# EAGLE schematic DM04ttl (EAGLE 6.6.0)

## Sheet 1 of 6
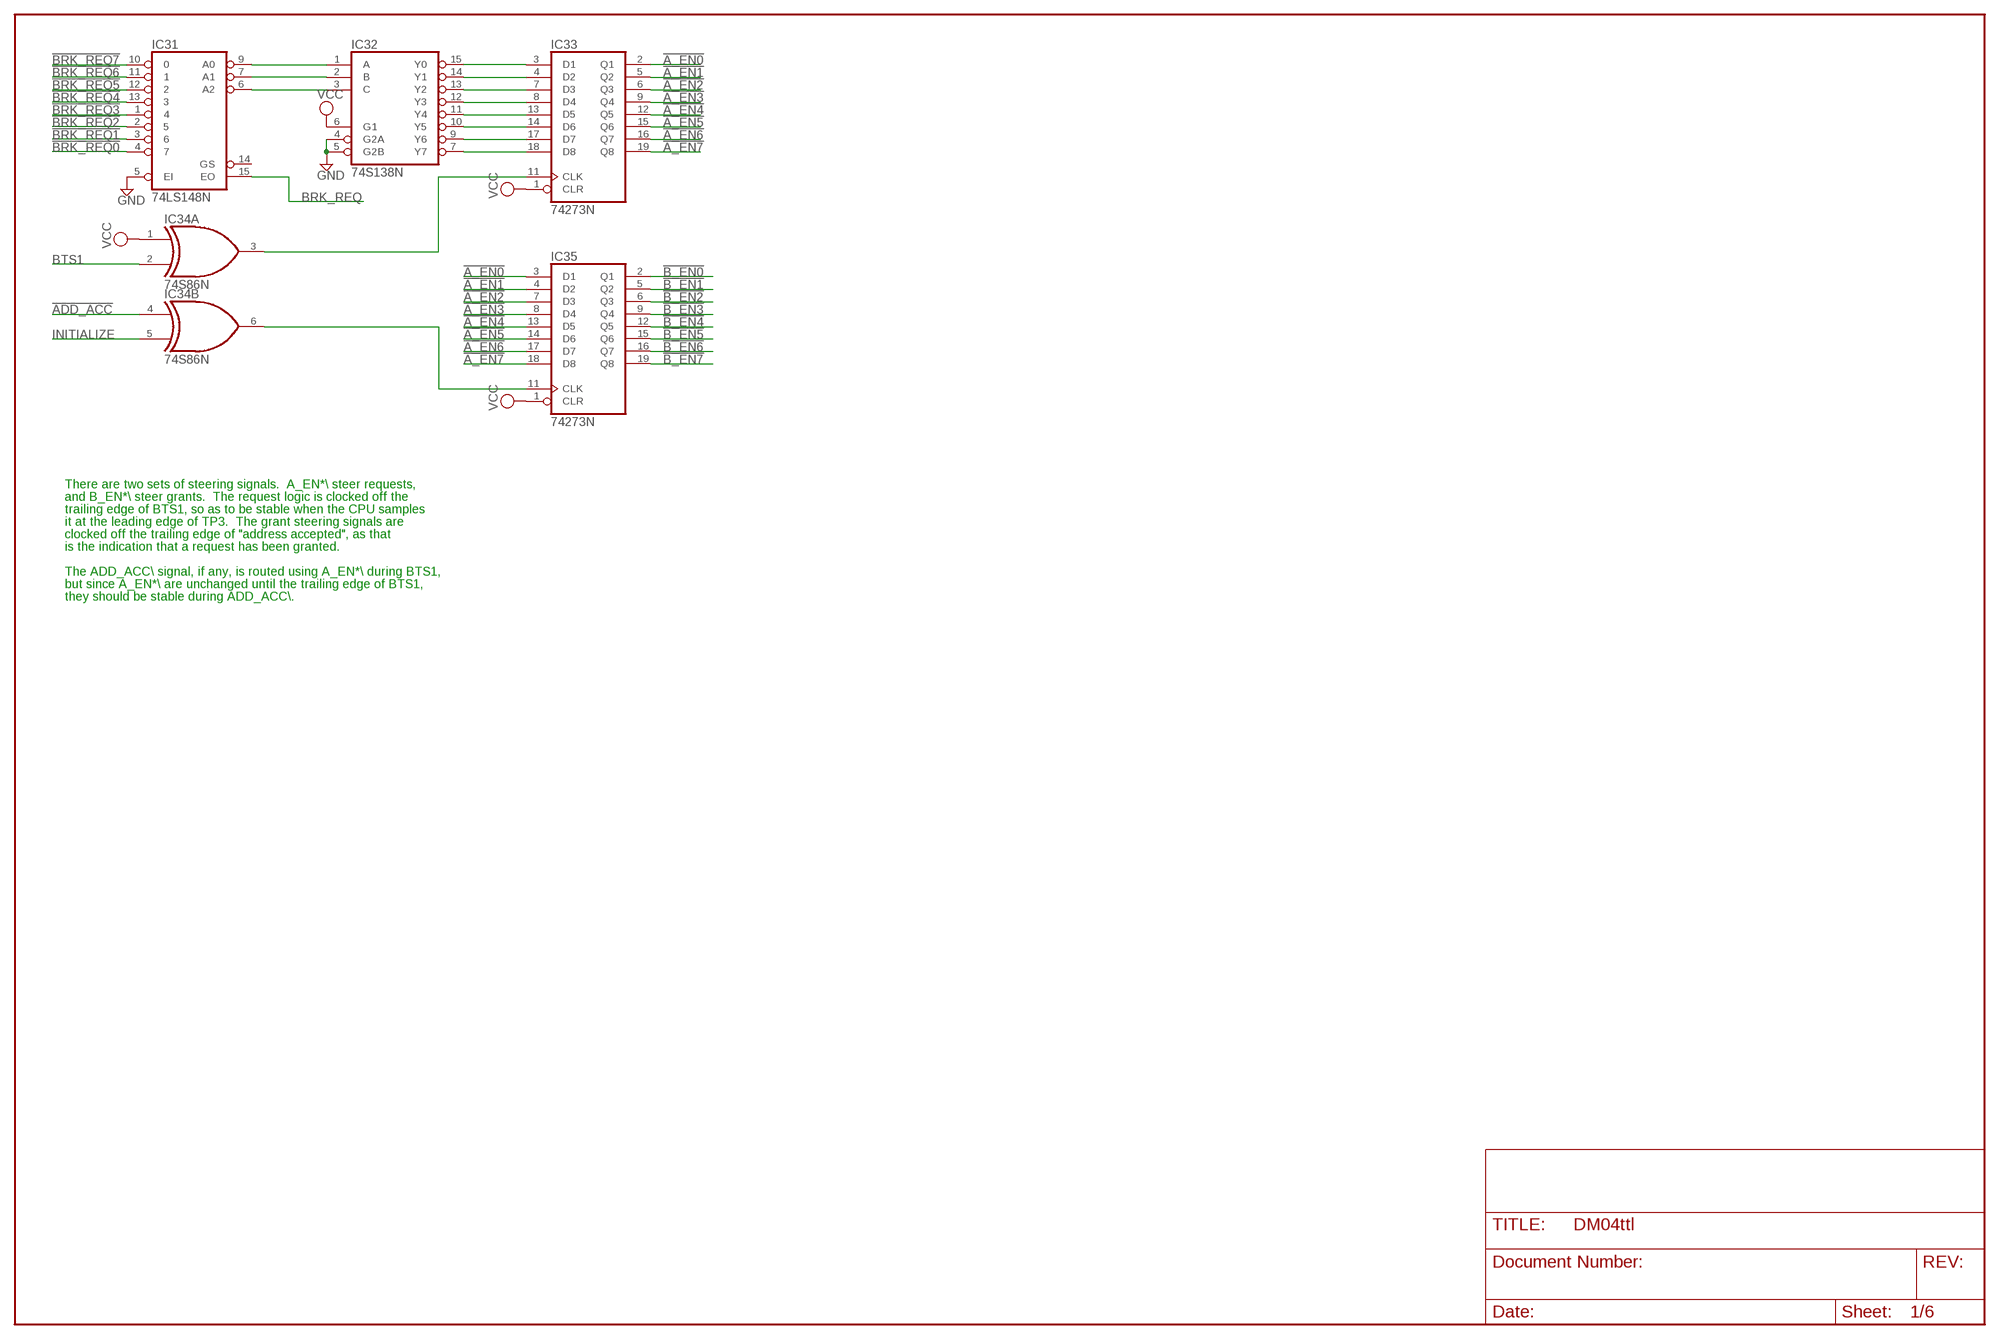
[diagram p0: schematic, sheet 1]

### Parts
IC31  74LS148N  [DIL16]
IC32  74S138N  [DIL16]
IC33  74273N  [DIL20]
IC34  74S86N  [DIL14]
IC35  74273N  [DIL20]

### Nets
!A_EN0: IC33.2(Q1) IC35.3(D1) ; also sheet 4,6
!A_EN1: IC33.5(Q2) IC35.4(D2) ; also sheet 4,6
!A_EN2: IC33.6(Q3) IC35.7(D3) ; also sheet 4,6
!A_EN3: IC33.9(Q4) IC35.8(D4) ; also sheet 4,6
!A_EN4: IC33.12(Q5) IC35.13(D5) ; also sheet 3
!A_EN5: IC33.15(Q6) IC35.14(D6) ; also sheet 3
!A_EN6: IC33.16(Q7) IC35.17(D7) ; also sheet 3
!A_EN7: IC33.19(Q8) IC35.18(D8) ; also sheet 3
!ADD_ACC: IC34.4(B:I0) ; also sheet 3,6
!B_EN0: IC35.2(Q1) ; also sheet 5,6
!B_EN1: IC35.5(Q2) ; also sheet 5,6
!B_EN2: IC35.6(Q3) ; also sheet 5,6
!B_EN3: IC35.9(Q4) ; also sheet 5,6
!B_EN4: IC35.12(Q5) ; also sheet 3
!B_EN5: IC35.15(Q6) ; also sheet 3
!B_EN6: IC35.16(Q7) ; also sheet 3
!B_EN7: IC35.19(Q8) ; also sheet 3
!BRK_REQ0: IC31.4 ; also sheet 3
!BRK_REQ1: IC31.3 ; also sheet 3
!BRK_REQ2: IC31.2 ; also sheet 3
!BRK_REQ3: IC31.1 ; also sheet 3
!BRK_REQ4: IC31.13 ; also sheet 3
!BRK_REQ5: IC31.12 ; also sheet 3
!BRK_REQ6: IC31.11 ; also sheet 3
!BRK_REQ7: IC31.10 ; also sheet 3
BRK_REQ: IC31.15(EO) ; also sheet 5
BTS1: IC34.2(A:I1) ; also sheet 2
GND [Supply]: IC31.5(EI) IC32.4(G2A) IC32.5(G2B) ; also sheet 2,3,4,5,6
INITIALIZE: IC34.5(B:I1) ; also sheet 3
N$2: IC31.6(A2) IC32.3(C)
N$3: IC34.6(B:O) IC35.11(CLK)
N$6: IC31.7(A1) IC32.2(B)
N$8: IC31.9(A0) IC32.1(A)
N$12: IC32.15(Y0) IC33.3(D1)
N$14: IC32.7(Y7) IC33.18(D8)
N$16: IC32.9(Y6) IC33.17(D7)
N$18: IC32.10(Y5) IC33.14(D6)
N$20: IC32.11(Y4) IC33.13(D5)
N$22: IC32.12(Y3) IC33.8(D4)
N$24: IC32.13(Y2) IC33.7(D3)
N$26: IC32.14(Y1) IC33.4(D2)
N$27: IC33.11(CLK) IC34.3(A:O)
VCC [Supply]: IC32.6(G1) IC33.1(CLR) IC34.1(A:I0) IC35.1(CLR) ; also sheet 2,3
Unconnected: IC31.14(GS) IC34.8(C:O) IC34.9(C:I0) IC34.10(C:I1) IC34.11(D:O) IC34.12(D:I0) IC34.13(D:I1)

### Notes on the sheet
- There are two sets of steering signals.  A_EN*\\ steer requests,
- and B_EN*\\ steer grants.  The request logic is clocked off the
- trailing edge of BTS1, so as to be stable when the CPU samples
- it at the leading edge of TP3.  The grant steering signals are
- clocked off the trailing edge of "address accepted", as that
- is the indication that a request has been granted.
- The ADD_ACC\\ signal, if any, is routed using A_EN*\\ during BTS1,
- but since A_EN*\\ are unchanged until the trailing edge of BTS1,
- they should be stable during ADD_ACC\\.

## Sheet 2 of 6
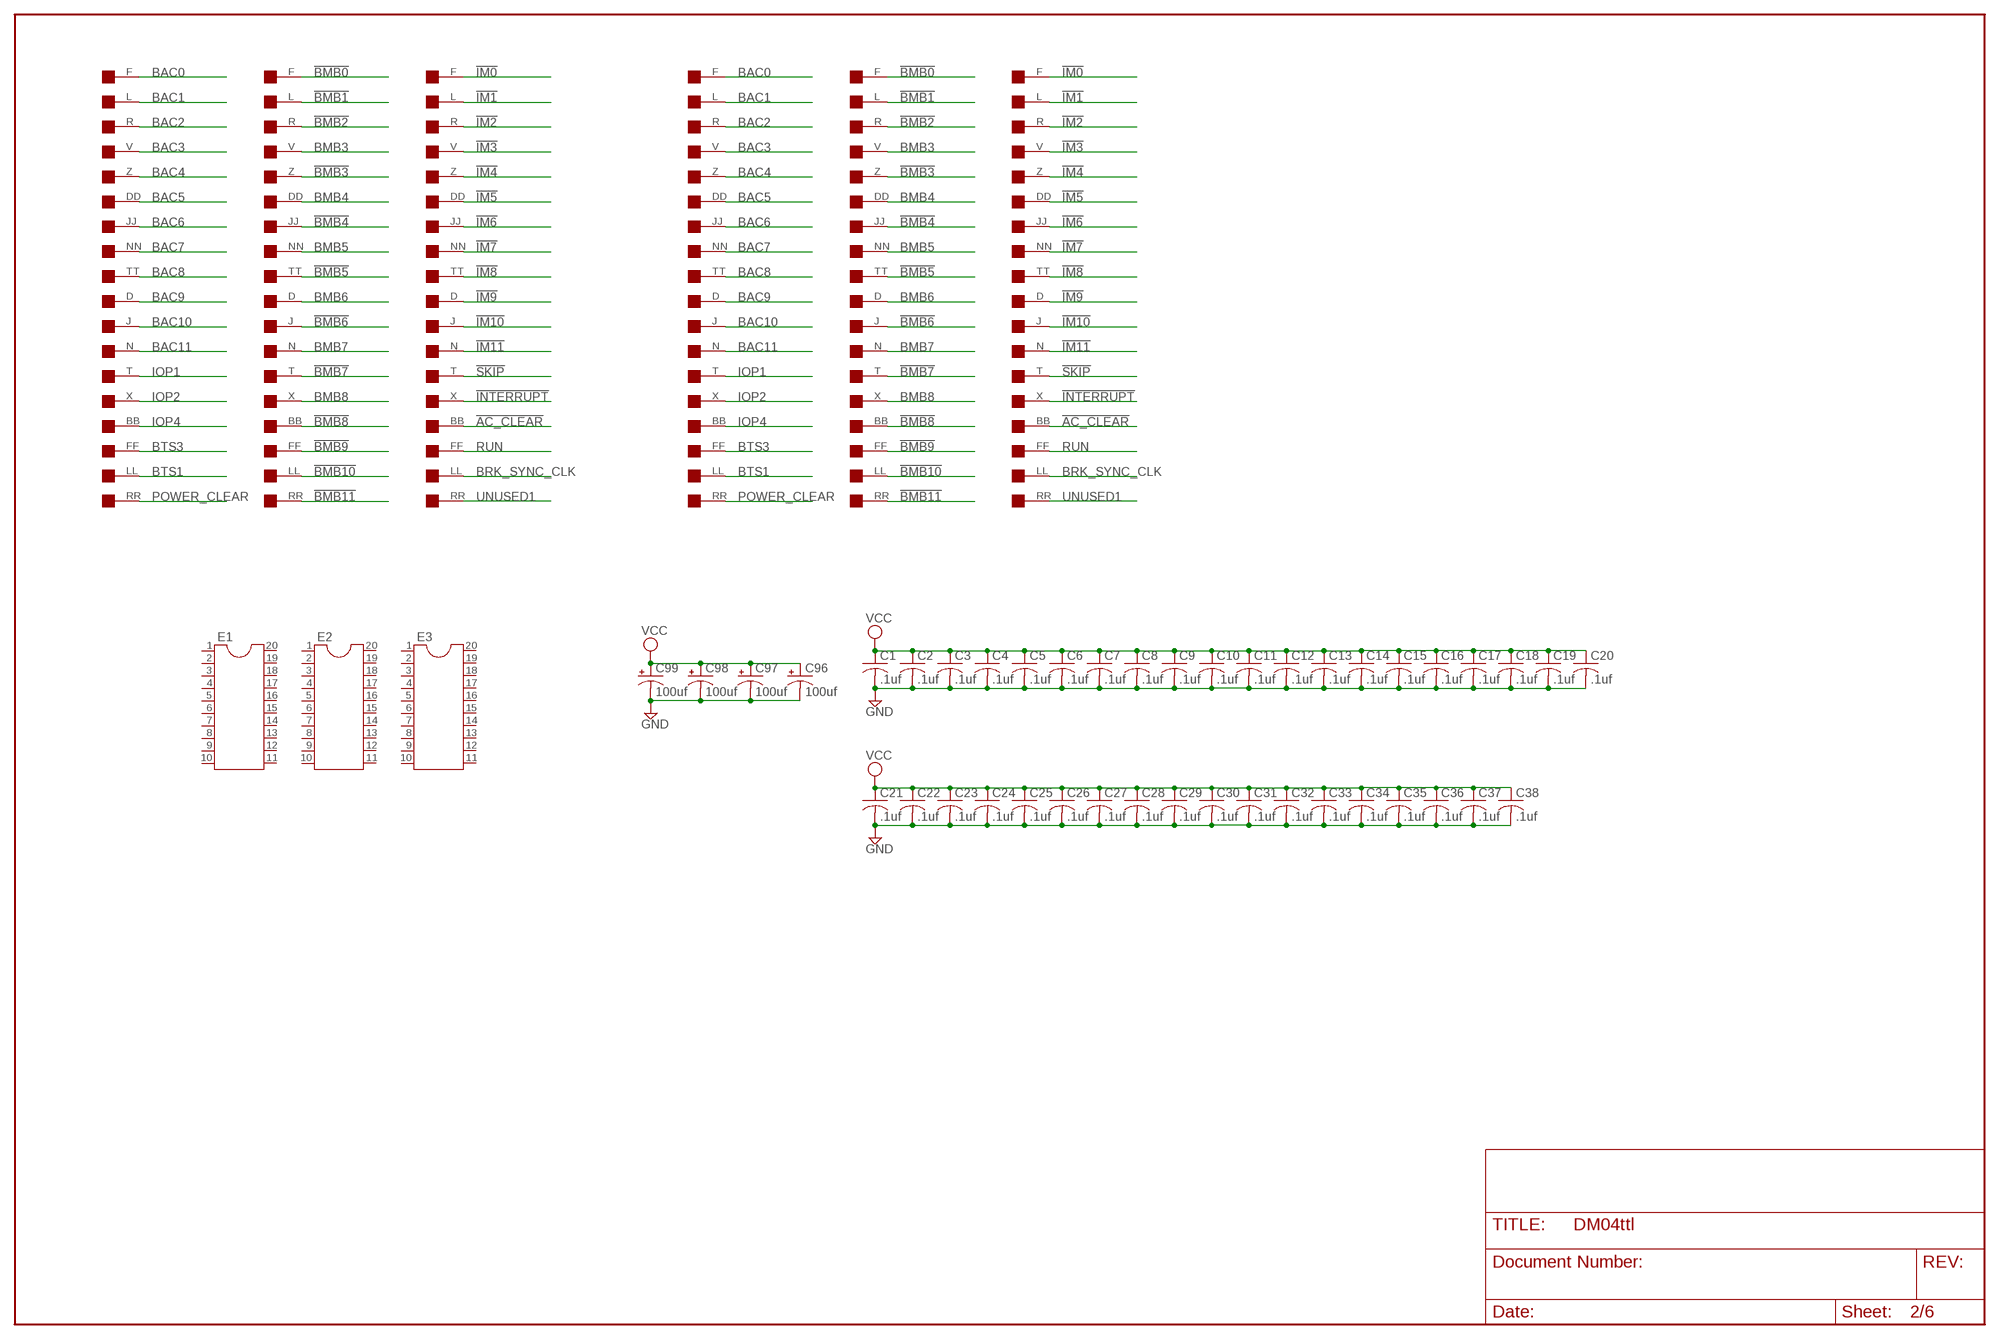
[diagram p1: schematic, sheet 2]

### Parts
AC0  BC08J  [DEC40PINV]
AC1  BC08J  [DEC40PINV]
BAC0  BC08J  [DEC40PINV]
BAC1  BC08J  [DEC40PINV]
BMB0  BC08J  [DEC40PINV]
BMB1  BC08J  [DEC40PINV]
C1  .1uf  C-US050-025X075  [C050-025X075]
C2  .1uf  C-US050-025X075  [C050-025X075]
C3  .1uf  C-US050-025X075  [C050-025X075]
C4  .1uf  C-US050-025X075  [C050-025X075]
C5  .1uf  C-US050-025X075  [C050-025X075]
C6  .1uf  C-US050-025X075  [C050-025X075]
C7  .1uf  C-US050-025X075  [C050-025X075]
C8  .1uf  C-US050-025X075  [C050-025X075]
C9  .1uf  C-US050-025X075  [C050-025X075]
C10  .1uf  C-US050-025X075  [C050-025X075]
C11  .1uf  C-US050-025X075  [C050-025X075]
C12  .1uf  C-US050-025X075  [C050-025X075]
C13  .1uf  C-US050-025X075  [C050-025X075]
C14  .1uf  C-US050-025X075  [C050-025X075]
C15  .1uf  C-US050-025X075  [C050-025X075]
C16  .1uf  C-US050-025X075  [C050-025X075]
C17  .1uf  C-US050-025X075  [C050-025X075]
C18  .1uf  C-US050-025X075  [C050-025X075]
C19  .1uf  C-US050-025X075  [C050-025X075]
C20  .1uf  C-US050-025X075  [C050-025X075]
C21  .1uf  C-US050-025X075  [C050-025X075]
C22  .1uf  C-US050-025X075  [C050-025X075]
C23  .1uf  C-US050-025X075  [C050-025X075]
C24  .1uf  C-US050-025X075  [C050-025X075]
C25  .1uf  C-US050-025X075  [C050-025X075]
C26  .1uf  C-US050-025X075  [C050-025X075]
C27  .1uf  C-US050-025X075  [C050-025X075]
C28  .1uf  C-US050-025X075  [C050-025X075]
C29  .1uf  C-US050-025X075  [C050-025X075]
C30  .1uf  C-US050-025X075  [C050-025X075]
C31  .1uf  C-US050-025X075  [C050-025X075]
C32  .1uf  C-US050-025X075  [C050-025X075]
C33  .1uf  C-US050-025X075  [C050-025X075]
C34  .1uf  C-US050-025X075  [C050-025X075]
C35  .1uf  C-US050-025X075  [C050-025X075]
C36  .1uf  C-US050-025X075  [C050-025X075]
C37  .1uf  C-US050-025X075  [C050-025X075]
C38  .1uf  C-US050-025X075  [C050-025X075]
C96  100uf  CPOL-USE22-6AXIAL  [E22-6]
C97  100uf  CPOL-USE22-6AXIAL  [E22-6]
C98  100uf  CPOL-USE22-6AXIAL  [E22-6]
C99  100uf  CPOL-USE22-6AXIAL  [E22-6]
E1  DIL20  [DIL20]
E2  DIL20  [DIL20]
E3  DIL20  [DIL20]

### Nets
!AC_CLEAR: AC0.BB AC1.BB
!BMB0: BMB0.F BMB1.F
!BMB1: BMB0.L BMB1.L
!BMB2: BMB0.R BMB1.R
!BMB3: BMB0.Z BMB1.Z
!BMB4: BMB0.JJ BMB1.JJ
!BMB5: BMB0.TT BMB1.TT
!BMB6: BMB0.J BMB1.J
!BMB7: BMB0.T BMB1.T
!BMB8: BMB0.BB BMB1.BB
!BMB9: BMB0.FF BMB1.FF
!BMB10: BMB0.LL BMB1.LL
!BMB11: BMB0.RR BMB1.RR
!IM0: AC0.F AC1.F
!IM1: AC0.L AC1.L
!IM2: AC0.R AC1.R
!IM3: AC0.V AC1.V
!IM4: AC0.Z AC1.Z
!IM5: AC0.DD AC1.DD
!IM6: AC0.JJ AC1.JJ
!IM7: AC0.NN AC1.NN
!IM8: AC0.TT AC1.TT
!IM9: AC0.D AC1.D
!IM10: AC0.J AC1.J
!IM11: AC0.N AC1.N
!INTERRUPT: AC0.X AC1.X
!SKIP: AC0.T AC1.T
BAC0: BAC0.F BAC1.F
BAC1: BAC0.L BAC1.L
BAC2: BAC0.R BAC1.R
BAC3: BAC0.V BAC1.V
BAC4: BAC0.Z BAC1.Z
BAC5: BAC0.DD BAC1.DD
BAC6: BAC0.JJ BAC1.JJ
BAC7: BAC0.NN BAC1.NN
BAC8: BAC0.TT BAC1.TT
BAC9: BAC0.D BAC1.D
BAC10: BAC0.J BAC1.J
BAC11: BAC0.N BAC1.N
BMB3: BMB0.V BMB1.V
BMB4: BMB0.DD BMB1.DD
BMB5: BMB0.NN BMB1.NN
BMB6: BMB0.D BMB1.D
BMB7: BMB0.N BMB1.N
BMB8: BMB0.X BMB1.X
BRK_SYNC_CLK: AC0.LL AC1.LL
BTS1: BAC0.LL BAC1.LL ; also sheet 1
BTS3: BAC0.FF BAC1.FF
GND [Supply]: C1.2 C2.2 C3.2 C4.2 C5.2 C6.2 C7.2 C8.2 C9.2 C10.2 C11.2 C12.2 C13.2 C14.2 C15.2 C16.2 C17.2 C18.2 C19.2 C20.2 C21.2 C22.2 C23.2 C24.2 C25.2 C26.2 C27.2 C28.2 C29.2 C30.2 C31.2 C32.2 C33.2 C34.2 C35.2 C36.2 C37.2 C38.2 C96.- C97.- C98.- C99.- ; also sheet 1,3,4,5,6
IOP1: BAC0.T BAC1.T
IOP2: BAC0.X BAC1.X
IOP4: BAC0.BB BAC1.BB
POWER_CLEAR: BAC0.RR BAC1.RR
RUN: AC0.FF AC1.FF
UNUSED1: AC0.RR AC1.RR
VCC [Supply]: C1.1 C2.1 C3.1 C4.1 C5.1 C6.1 C7.1 C8.1 C9.1 C10.1 C11.1 C12.1 C13.1 C14.1 C15.1 C16.1 C17.1 C18.1 C19.1 C20.1 C21.1 C22.1 C23.1 C24.1 C25.1 C26.1 C27.1 C28.1 C29.1 C30.1 C31.1 C32.1 C33.1 C34.1 C35.1 C36.1 C37.1 C38.1 C96.+ C97.+ C98.+ C99.+ ; also sheet 1,3
Unconnected: E1.1 E1.2 E1.3 E1.4 E1.5 E1.6 E1.7 E1.8 E1.9 E1.10 E1.11 E1.12 E1.13 E1.14 E1.15 E1.16 E1.17 E1.18 E1.19 E1.20 E2.1 E2.2 E2.3 E2.4 E2.5 E2.6 E2.7 E2.8 E2.9 E2.10 E2.11 E2.12 E2.13 E2.14 E2.15 E2.16 E2.17 E2.18 E2.19 E2.20 E3.1 E3.2 E3.3 E3.4 E3.5 E3.6 E3.7 E3.8 E3.9 E3.10 E3.11 E3.12 E3.13 E3.14 E3.15 E3.16 E3.17 E3.18 E3.19 E3.20

## Sheet 3 of 6
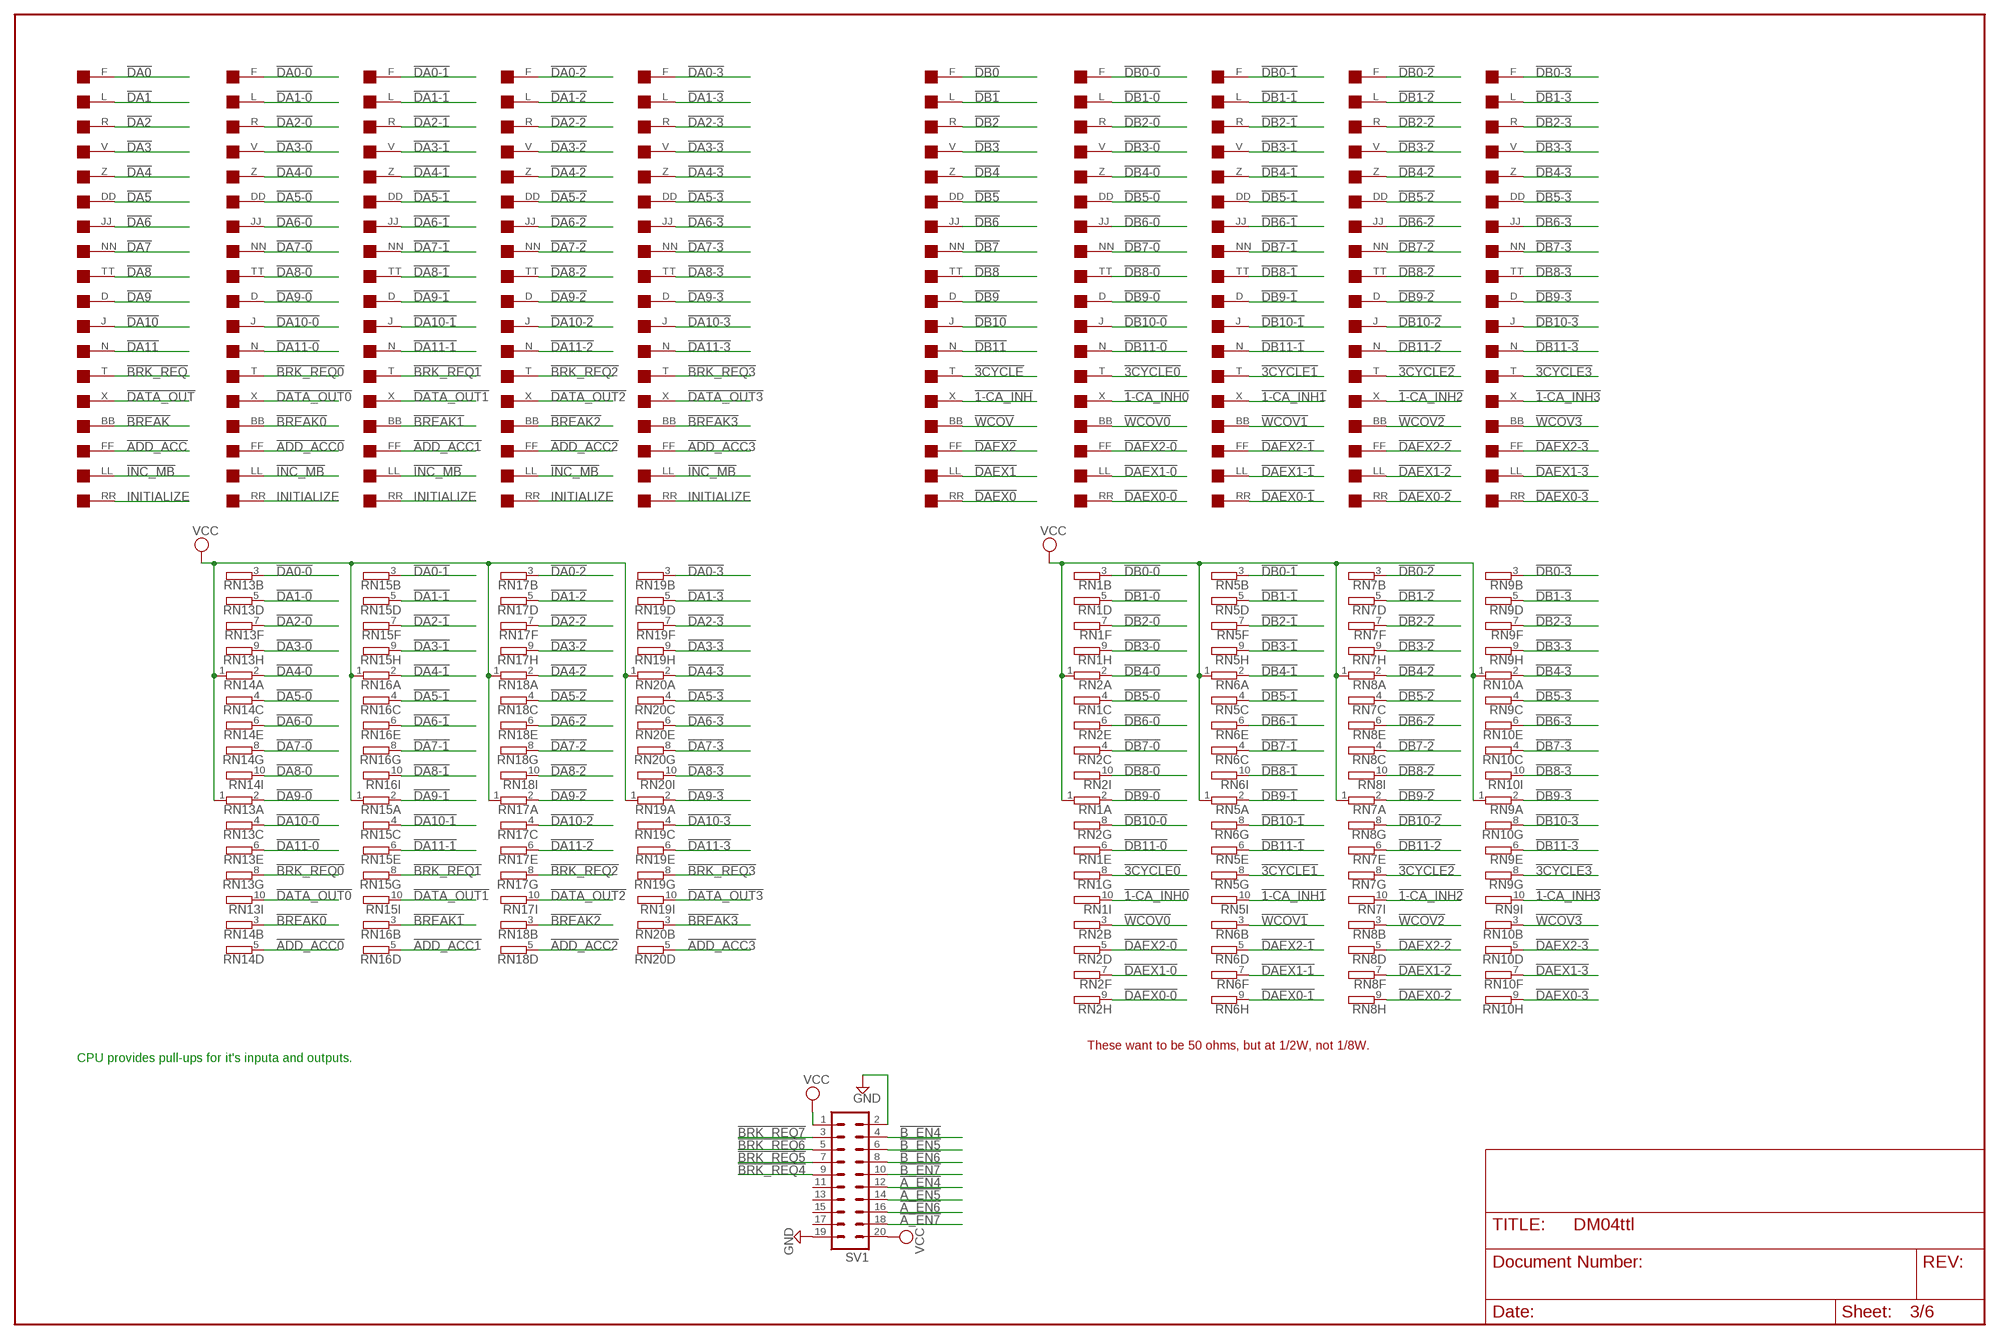
[diagram p2: schematic, sheet 3]

### Parts
ADDRESS  BC08J  [DEC40PINV]
ADDRESS0  BC08J  [DEC40PINV]
ADDRESS1  BC08J  [DEC40PINV]
ADDRESS2  BC08J  [DEC40PINV]
ADDRESS3  BC08J  [DEC40PINV]
DATA  BC08J  [DEC40PINV]
DATA0  BC08J  [DEC40PINV]
DATA1  BC08J  [DEC40PINV]
DATA2  BC08J  [DEC40PINV]
DATA3  BC08J  [DEC40PINV]
RN1  GE09R  [SIL10]
RN2  GE09R  [SIL10]
RN5  GE09R  [SIL10]
RN6  GE09R  [SIL10]
RN7  GE09R  [SIL10]
RN8  GE09R  [SIL10]
RN9  GE09R  [SIL10]
RN10  GE09R  [SIL10]
RN13  GE09R  [SIL10]
RN14  GE09R  [SIL10]
RN15  GE09R  [SIL10]
RN16  GE09R  [SIL10]
RN17  GE09R  [SIL10]
RN18  GE09R  [SIL10]
RN19  GE09R  [SIL10]
RN20  GE09R  [SIL10]
SV1  MA10-2  [MA10-2]

### Nets
!1-CA_INH: DATA.X ; also sheet 5
!1-CA_INH0: DATA0.X RN1.10 ; also sheet 5
!1-CA_INH1: DATA1.X RN5.10 ; also sheet 5
!1-CA_INH2: DATA2.X RN7.10 ; also sheet 5
!1-CA_INH3: DATA3.X RN9.10 ; also sheet 5
!3CYCLE: DATA.T ; also sheet 4
!3CYCLE0: DATA0.T RN1.8 ; also sheet 4
!3CYCLE1: DATA1.T RN5.8 ; also sheet 4
!3CYCLE2: DATA2.T RN7.8 ; also sheet 4
!3CYCLE3: DATA3.T RN9.8 ; also sheet 4
!A_EN4: SV1.12 ; also sheet 1
!A_EN5: SV1.14 ; also sheet 1
!A_EN6: SV1.16 ; also sheet 1
!A_EN7: SV1.18 ; also sheet 1
!ADD_ACC: ADDRESS.FF ; also sheet 1,6
!ADD_ACC0: ADDRESS0.FF RN14.5 ; also sheet 6
!ADD_ACC1: ADDRESS1.FF RN16.5 ; also sheet 6
!ADD_ACC2: ADDRESS2.FF RN18.5 ; also sheet 6
!ADD_ACC3: ADDRESS3.FF RN20.5 ; also sheet 6
!B_EN4: SV1.4 ; also sheet 1
!B_EN5: SV1.6 ; also sheet 1
!B_EN6: SV1.8 ; also sheet 1
!B_EN7: SV1.10 ; also sheet 1
!BREAK: ADDRESS.BB ; also sheet 6
!BREAK0: ADDRESS0.BB RN14.3 ; also sheet 6
!BREAK1: ADDRESS1.BB RN16.3 ; also sheet 6
!BREAK2: ADDRESS2.BB RN18.3 ; also sheet 6
!BREAK3: ADDRESS3.BB RN20.3 ; also sheet 6
!BRK_REQ: ADDRESS.T ; also sheet 5
!BRK_REQ0: ADDRESS0.T RN13.8 ; also sheet 1
!BRK_REQ1: ADDRESS1.T RN15.8 ; also sheet 1
!BRK_REQ2: ADDRESS2.T RN17.8 ; also sheet 1
!BRK_REQ3: ADDRESS3.T RN19.8 ; also sheet 1
!BRK_REQ4: SV1.9 ; also sheet 1
!BRK_REQ5: SV1.7 ; also sheet 1
!BRK_REQ6: SV1.5 ; also sheet 1
!BRK_REQ7: SV1.3 ; also sheet 1
!DA0: ADDRESS.F ; also sheet 4
!DA0-0: ADDRESS0.F RN13.3 ; also sheet 4
!DA0-1: ADDRESS1.F RN15.3 ; also sheet 4
!DA0-2: ADDRESS2.F RN17.3 ; also sheet 4
!DA0-3: ADDRESS3.F RN19.3 ; also sheet 4
!DA1: ADDRESS.L ; also sheet 4
!DA1-0: ADDRESS0.L RN13.5 ; also sheet 4
!DA1-1: ADDRESS1.L RN15.5 ; also sheet 4
!DA1-2: ADDRESS2.L RN17.5 ; also sheet 4
!DA1-3: ADDRESS3.L RN19.5 ; also sheet 4
!DA2: ADDRESS.R ; also sheet 4
!DA2-0: ADDRESS0.R RN13.7 ; also sheet 4
!DA2-1: ADDRESS1.R RN15.7 ; also sheet 4
!DA2-2: ADDRESS2.R RN17.7 ; also sheet 4
!DA2-3: ADDRESS3.R RN19.7 ; also sheet 4
!DA3: ADDRESS.V ; also sheet 4
!DA3-0: ADDRESS0.V RN13.9 ; also sheet 4
!DA3-1: ADDRESS1.V RN15.9 ; also sheet 4
!DA3-2: ADDRESS2.V RN17.9 ; also sheet 4
!DA3-3: ADDRESS3.V RN19.9 ; also sheet 4
!DA4: ADDRESS.Z ; also sheet 4
!DA4-0: ADDRESS0.Z RN14.2 ; also sheet 4
!DA4-1: ADDRESS1.Z RN16.2 ; also sheet 4
!DA4-2: ADDRESS2.Z RN18.2 ; also sheet 4
!DA4-3: ADDRESS3.Z RN20.2 ; also sheet 4
!DA5: ADDRESS.DD ; also sheet 4
!DA5-0: ADDRESS0.DD RN14.4 ; also sheet 4
!DA5-1: ADDRESS1.DD RN16.4 ; also sheet 4
!DA5-2: ADDRESS2.DD RN18.4 ; also sheet 4
!DA5-3: ADDRESS3.DD RN20.4 ; also sheet 4
!DA6: ADDRESS.JJ ; also sheet 4
!DA6-0: ADDRESS0.JJ RN14.6 ; also sheet 4
!DA6-1: ADDRESS1.JJ RN16.6 ; also sheet 4
!DA6-2: ADDRESS2.JJ RN18.6 ; also sheet 4
!DA6-3: ADDRESS3.JJ RN20.6 ; also sheet 4
!DA7: ADDRESS.NN ; also sheet 4
!DA7-0: ADDRESS0.NN RN14.8 ; also sheet 4
!DA7-1: ADDRESS1.NN RN16.8 ; also sheet 4
!DA7-2: ADDRESS2.NN RN18.8 ; also sheet 4
!DA7-3: ADDRESS3.NN RN20.8 ; also sheet 4
!DA8: ADDRESS.TT ; also sheet 4
!DA8-0: ADDRESS0.TT RN14.10 ; also sheet 4
!DA8-1: ADDRESS1.TT RN16.10 ; also sheet 4
!DA8-2: ADDRESS2.TT RN18.10 ; also sheet 4
!DA8-3: ADDRESS3.TT RN20.10 ; also sheet 4
!DA9: ADDRESS.D ; also sheet 4
!DA9-0: ADDRESS0.D RN13.2 ; also sheet 4
!DA9-1: ADDRESS1.D RN15.2 ; also sheet 4
!DA9-2: ADDRESS2.D RN17.2 ; also sheet 4
!DA9-3: ADDRESS3.D RN19.2 ; also sheet 4
!DA10: ADDRESS.J ; also sheet 4
!DA10-0: ADDRESS0.J RN13.4 ; also sheet 4
!DA10-1: ADDRESS1.J RN15.4 ; also sheet 4
!DA10-2: ADDRESS2.J RN17.4 ; also sheet 4
!DA10-3: ADDRESS3.J RN19.4 ; also sheet 4
!DA11: ADDRESS.N ; also sheet 4
!DA11-0: ADDRESS0.N RN13.6 ; also sheet 4
!DA11-1: ADDRESS1.N RN15.6 ; also sheet 4
!DA11-2: ADDRESS2.N RN17.6 ; also sheet 4
!DA11-3: ADDRESS3.N RN19.6 ; also sheet 4
!DAEX0: DATA.RR ; also sheet 4
!DAEX0-0: DATA0.RR RN2.9 ; also sheet 4
!DAEX0-1: DATA1.RR RN6.9 ; also sheet 4
!DAEX0-2: DATA2.RR RN8.9 ; also sheet 4
!DAEX0-3: DATA3.RR RN10.9 ; also sheet 4
!DAEX1: DATA.LL ; also sheet 4
!DAEX1-0: DATA0.LL RN2.7 ; also sheet 4
!DAEX1-1: DATA1.LL RN6.7 ; also sheet 4
!DAEX1-2: DATA2.LL RN8.7 ; also sheet 4
!DAEX1-3: DATA3.LL RN10.7 ; also sheet 4
!DAEX2: DATA.FF ; also sheet 4
!DAEX2-0: DATA0.FF RN2.5 ; also sheet 4
!DAEX2-1: DATA1.FF RN6.5 ; also sheet 4
!DAEX2-2: DATA2.FF RN8.5 ; also sheet 4
!DAEX2-3: DATA3.FF RN10.5 ; also sheet 4
!DATA_OUT: ADDRESS.X ; also sheet 5
!DATA_OUT0: ADDRESS0.X RN13.10 ; also sheet 5
!DATA_OUT1: ADDRESS1.X RN15.10 ; also sheet 5
!DATA_OUT2: ADDRESS2.X RN17.10 ; also sheet 5
!DATA_OUT3: ADDRESS3.X RN19.10 ; also sheet 5
!DB0: DATA.F ; also sheet 5
!DB0-0: DATA0.F RN1.3 ; also sheet 5
!DB0-1: DATA1.F RN5.3 ; also sheet 5
!DB0-2: DATA2.F RN7.3 ; also sheet 5
!DB0-3: DATA3.F RN9.3 ; also sheet 5
!DB1: DATA.L ; also sheet 5
!DB1-0: DATA0.L RN1.5 ; also sheet 5
!DB1-1: DATA1.L RN5.5 ; also sheet 5
!DB1-2: DATA2.L RN7.5 ; also sheet 5
!DB1-3: DATA3.L RN9.5 ; also sheet 5
!DB2: DATA.R ; also sheet 5
!DB2-0: DATA0.R RN1.7 ; also sheet 5
!DB2-1: DATA1.R RN5.7 ; also sheet 5
!DB2-2: DATA2.R RN7.7 ; also sheet 5
!DB2-3: DATA3.R RN9.7 ; also sheet 5
!DB3: DATA.V ; also sheet 5
!DB3-0: DATA0.V RN1.9 ; also sheet 5
!DB3-1: DATA1.V RN5.9 ; also sheet 5
!DB3-2: DATA2.V RN7.9 ; also sheet 5
!DB3-3: DATA3.V RN9.9 ; also sheet 5
!DB4: DATA.Z ; also sheet 5
!DB4-0: DATA0.Z RN2.2 ; also sheet 5
!DB4-1: DATA1.Z RN6.2 ; also sheet 5
!DB4-2: DATA2.Z RN8.2 ; also sheet 5
!DB4-3: DATA3.Z RN10.2 ; also sheet 5
!DB5: DATA.DD ; also sheet 5
!DB5-0: DATA0.DD RN1.4 ; also sheet 5
!DB5-1: DATA1.DD RN5.4 ; also sheet 5
!DB5-2: DATA2.DD RN7.4 ; also sheet 5
!DB5-3: DATA3.DD RN9.4 ; also sheet 5
!DB6: DATA.JJ ; also sheet 5
!DB6-0: DATA0.JJ RN2.6 ; also sheet 5
!DB6-1: DATA1.JJ RN6.6 ; also sheet 5
!DB6-2: DATA2.JJ RN8.6 ; also sheet 5
!DB6-3: DATA3.JJ RN10.6 ; also sheet 5
!DB7: DATA.NN ; also sheet 5
!DB7-0: DATA0.NN RN2.4 ; also sheet 5
!DB7-1: DATA1.NN RN6.4 ; also sheet 5
!DB7-2: DATA2.NN RN8.4 ; also sheet 5
!DB7-3: DATA3.NN RN10.4 ; also sheet 5
!DB8: DATA.TT ; also sheet 5
!DB8-0: DATA0.TT RN2.10 ; also sheet 5
!DB8-1: DATA1.TT RN6.10 ; also sheet 5
!DB8-2: DATA2.TT RN8.10 ; also sheet 5
!DB8-3: DATA3.TT RN10.10 ; also sheet 5
!DB9: DATA.D ; also sheet 5
!DB9-0: DATA0.D RN1.2 ; also sheet 5
!DB9-1: DATA1.D RN5.2 ; also sheet 5
!DB9-2: DATA2.D RN7.2 ; also sheet 5
!DB9-3: DATA3.D RN9.2 ; also sheet 5
!DB10: DATA.J ; also sheet 5
!DB10-0: DATA0.J RN2.8 ; also sheet 5
!DB10-1: DATA1.J RN6.8 ; also sheet 5
!DB10-2: DATA2.J RN8.8 ; also sheet 5
!DB10-3: DATA3.J RN10.8 ; also sheet 5
!DB11: DATA.N ; also sheet 5
!DB11-0: DATA0.N RN1.6 ; also sheet 5
!DB11-1: DATA1.N RN5.6 ; also sheet 5
!DB11-2: DATA2.N RN7.6 ; also sheet 5
!DB11-3: DATA3.N RN9.6 ; also sheet 5
!INC_MB: ADDRESS0.LL ADDRESS1.LL ADDRESS2.LL ADDRESS3.LL ADDRESS.LL
!WCOV: DATA.BB ; also sheet 6
!WCOV0: DATA0.BB RN2.3 ; also sheet 6
!WCOV1: DATA1.BB RN6.3 ; also sheet 6
!WCOV2: DATA2.BB RN8.3 ; also sheet 6
!WCOV3: DATA3.BB RN10.3 ; also sheet 6
GND [Supply]: SV1.2 SV1.19 ; also sheet 1,2,4,5,6
INITIALIZE: ADDRESS0.RR ADDRESS1.RR ADDRESS2.RR ADDRESS3.RR ADDRESS.RR ; also sheet 1
VCC [Supply]: RN1.1 RN2.1 RN5.1 RN6.1 RN7.1 RN8.1 RN9.1 RN10.1 RN13.1 RN14.1 RN15.1 RN16.1 RN17.1 RN18.1 RN19.1 RN20.1 SV1.1 SV1.20 ; also sheet 1,2
Unconnected: RN14.7 RN14.9 RN16.7 RN16.9 RN18.7 RN18.9 RN20.7 RN20.9 SV1.11 SV1.13 SV1.15 SV1.17

### Notes on the sheet
- These want to be 50 ohms, but at 1/2W, not 1/8W.
- CPU provides pull-ups for it's inputa and outputs.

## Sheet 4 of 6
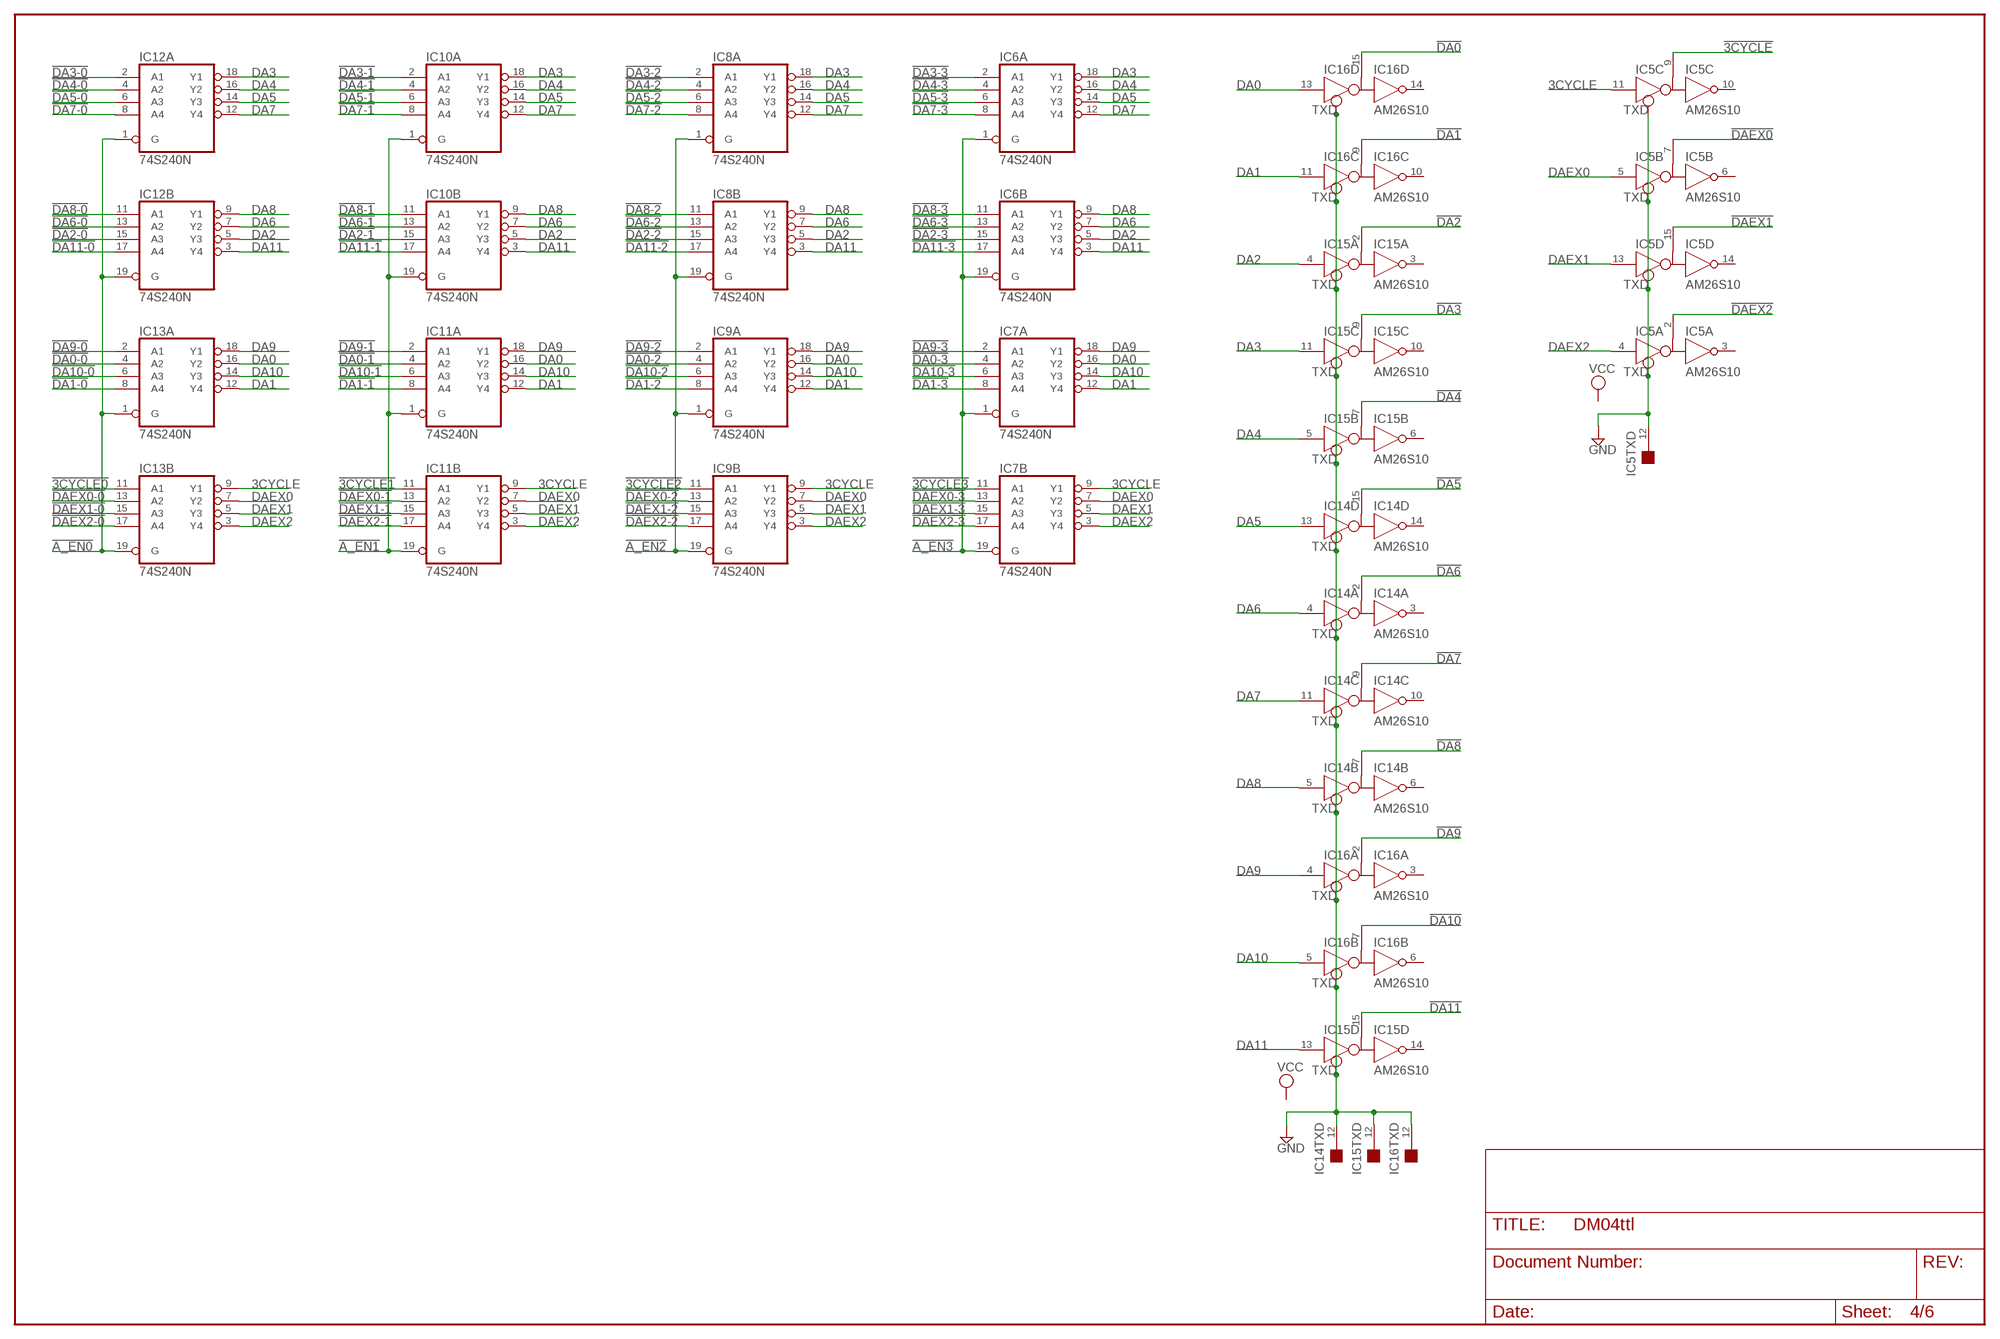
[diagram p3: schematic, sheet 4]

### Parts
IC5  AM26S10  [DIL16]
IC6  74S240N  [DIL20]
IC7  74S240N  [DIL20]
IC8  74S240N  [DIL20]
IC9  74S240N  [DIL20]
IC10  74S240N  [DIL20]
IC11  74S240N  [DIL20]
IC12  74S240N  [DIL20]
IC13  74S240N  [DIL20]
IC14  AM26S10  [DIL16]
IC15  AM26S10  [DIL16]
IC16  AM26S10  [DIL16]

### Nets
3CYCLE: IC5.11(C:D) IC7.9(B:Y1) IC9.9(B:Y1) IC11.9(B:Y1) IC13.9(B:Y1)
!3CYCLE: IC5.9(C:B) ; also sheet 3
!3CYCLE0: IC13.11(B:A1) ; also sheet 3
!3CYCLE1: IC11.11(B:A1) ; also sheet 3
!3CYCLE2: IC9.11(B:A1) ; also sheet 3
!3CYCLE3: IC7.11(B:A1) ; also sheet 3
!A_EN0: IC12.1(A:G) IC12.19(B:G) IC13.1(A:G) IC13.19(B:G) ; also sheet 1,6
!A_EN1: IC10.1(A:G) IC10.19(B:G) IC11.1(A:G) IC11.19(B:G) ; also sheet 1,6
!A_EN2: IC8.1(A:G) IC8.19(B:G) IC9.1(A:G) IC9.19(B:G) ; also sheet 1,6
!A_EN3: IC6.1(A:G) IC6.19(B:G) IC7.1(A:G) IC7.19(B:G) ; also sheet 1,6
!DA0: IC16.15(D:B) ; also sheet 3
!DA0-0: IC13.4(A:A2) ; also sheet 3
!DA0-1: IC11.4(A:A2) ; also sheet 3
!DA0-2: IC9.4(A:A2) ; also sheet 3
!DA0-3: IC7.4(A:A2) ; also sheet 3
!DA1: IC16.9(C:B) ; also sheet 3
!DA1-0: IC13.8(A:A4) ; also sheet 3
!DA1-1: IC11.8(A:A4) ; also sheet 3
!DA1-2: IC9.8(A:A4) ; also sheet 3
!DA1-3: IC7.8(A:A4) ; also sheet 3
!DA2: IC15.2(A:B) ; also sheet 3
!DA2-0: IC12.15(B:A3) ; also sheet 3
!DA2-1: IC10.15(B:A3) ; also sheet 3
!DA2-2: IC8.15(B:A3) ; also sheet 3
!DA2-3: IC6.15(B:A3) ; also sheet 3
!DA3: IC15.9(C:B) ; also sheet 3
!DA3-0: IC12.2(A:A1) ; also sheet 3
!DA3-1: IC10.2(A:A1) ; also sheet 3
!DA3-2: IC8.2(A:A1) ; also sheet 3
!DA3-3: IC6.2(A:A1) ; also sheet 3
!DA4: IC15.7(B:B) ; also sheet 3
!DA4-0: IC12.4(A:A2) ; also sheet 3
!DA4-1: IC10.4(A:A2) ; also sheet 3
!DA4-2: IC8.4(A:A2) ; also sheet 3
!DA4-3: IC6.4(A:A2) ; also sheet 3
!DA5: IC14.15(D:B) ; also sheet 3
!DA5-0: IC12.6(A:A3) ; also sheet 3
!DA5-1: IC10.6(A:A3) ; also sheet 3
!DA5-2: IC8.6(A:A3) ; also sheet 3
!DA5-3: IC6.6(A:A3) ; also sheet 3
!DA6: IC14.2(A:B) ; also sheet 3
!DA6-0: IC12.13(B:A2) ; also sheet 3
!DA6-1: IC10.13(B:A2) ; also sheet 3
!DA6-2: IC8.13(B:A2) ; also sheet 3
!DA6-3: IC6.13(B:A2) ; also sheet 3
!DA7: IC14.9(C:B) ; also sheet 3
!DA7-0: IC12.8(A:A4) ; also sheet 3
!DA7-1: IC10.8(A:A4) ; also sheet 3
!DA7-2: IC8.8(A:A4) ; also sheet 3
!DA7-3: IC6.8(A:A4) ; also sheet 3
!DA8: IC14.7(B:B) ; also sheet 3
!DA8-0: IC12.11(B:A1) ; also sheet 3
!DA8-1: IC10.11(B:A1) ; also sheet 3
!DA8-2: IC8.11(B:A1) ; also sheet 3
!DA8-3: IC6.11(B:A1) ; also sheet 3
!DA9: IC16.2(A:B) ; also sheet 3
!DA9-0: IC13.2(A:A1) ; also sheet 3
!DA9-1: IC11.2(A:A1) ; also sheet 3
!DA9-2: IC9.2(A:A1) ; also sheet 3
!DA9-3: IC7.2(A:A1) ; also sheet 3
!DA10: IC16.7(B:B) ; also sheet 3
!DA10-0: IC13.6(A:A3) ; also sheet 3
!DA10-1: IC11.6(A:A3) ; also sheet 3
!DA10-2: IC9.6(A:A3) ; also sheet 3
!DA10-3: IC7.6(A:A3) ; also sheet 3
!DA11: IC15.15(D:B) ; also sheet 3
!DA11-0: IC12.17(B:A4) ; also sheet 3
!DA11-1: IC10.17(B:A4) ; also sheet 3
!DA11-2: IC8.17(B:A4) ; also sheet 3
!DA11-3: IC6.17(B:A4) ; also sheet 3
!DAEX0: IC5.7(B:B) ; also sheet 3
!DAEX0-0: IC13.13(B:A2) ; also sheet 3
!DAEX0-1: IC11.13(B:A2) ; also sheet 3
!DAEX0-2: IC9.13(B:A2) ; also sheet 3
!DAEX0-3: IC7.13(B:A2) ; also sheet 3
!DAEX1: IC5.15(D:B) ; also sheet 3
!DAEX1-0: IC13.15(B:A3) ; also sheet 3
!DAEX1-1: IC11.15(B:A3) ; also sheet 3
!DAEX1-2: IC9.15(B:A3) ; also sheet 3
!DAEX1-3: IC7.15(B:A3) ; also sheet 3
!DAEX2: IC5.2(A:B) ; also sheet 3
!DAEX2-0: IC13.17(B:A4) ; also sheet 3
!DAEX2-1: IC11.17(B:A4) ; also sheet 3
!DAEX2-2: IC9.17(B:A4) ; also sheet 3
!DAEX2-3: IC7.17(B:A4) ; also sheet 3
DA0: IC7.16(A:Y2) IC9.16(A:Y2) IC11.16(A:Y2) IC13.16(A:Y2) IC16.13(D:D)
DA1: IC7.12(A:Y4) IC9.12(A:Y4) IC11.12(A:Y4) IC13.12(A:Y4) IC16.11(C:D)
DA2: IC6.5(B:Y3) IC8.5(B:Y3) IC10.5(B:Y3) IC12.5(B:Y3) IC15.4(A:D)
DA3: IC6.18(A:Y1) IC8.18(A:Y1) IC10.18(A:Y1) IC12.18(A:Y1) IC15.11(C:D)
DA4: IC6.16(A:Y2) IC8.16(A:Y2) IC10.16(A:Y2) IC12.16(A:Y2) IC15.5(B:D)
DA5: IC6.14(A:Y3) IC8.14(A:Y3) IC10.14(A:Y3) IC12.14(A:Y3) IC14.13(D:D)
DA6: IC6.7(B:Y2) IC8.7(B:Y2) IC10.7(B:Y2) IC12.7(B:Y2) IC14.4(A:D)
DA7: IC6.12(A:Y4) IC8.12(A:Y4) IC10.12(A:Y4) IC12.12(A:Y4) IC14.11(C:D)
DA8: IC6.9(B:Y1) IC8.9(B:Y1) IC10.9(B:Y1) IC12.9(B:Y1) IC14.5(B:D)
DA9: IC7.18(A:Y1) IC9.18(A:Y1) IC11.18(A:Y1) IC13.18(A:Y1) IC16.4(A:D)
DA10: IC7.14(A:Y3) IC9.14(A:Y3) IC11.14(A:Y3) IC13.14(A:Y3) IC16.5(B:D)
DA11: IC6.3(B:Y4) IC8.3(B:Y4) IC10.3(B:Y4) IC12.3(B:Y4) IC15.13(D:D)
DAEX0: IC5.5(B:D) IC7.7(B:Y2) IC9.7(B:Y2) IC11.7(B:Y2) IC13.7(B:Y2)
DAEX1: IC5.13(D:D) IC7.5(B:Y3) IC9.5(B:Y3) IC11.5(B:Y3) IC13.5(B:Y3)
DAEX2: IC5.4(A:D) IC7.3(B:Y4) IC9.3(B:Y4) IC11.3(B:Y4) IC13.3(B:Y4)
GND [Supply]: IC5.12(TXD:TXD) IC14.12(TXD:TXD) IC15.12(TXD:TXD) IC16.12(TXD:TXD) ; also sheet 1,2,3,5,6
Unconnected: IC5.3(A:R) IC5.6(B:R) IC5.10(C:R) IC5.14(D:R) IC14.3(A:R) IC14.6(B:R) IC14.10(C:R) IC14.14(D:R) IC15.3(A:R) IC15.6(B:R) IC15.10(C:R) IC15.14(D:R) IC16.3(A:R) IC16.6(B:R) IC16.10(C:R) IC16.14(D:R)

## Sheet 5 of 6
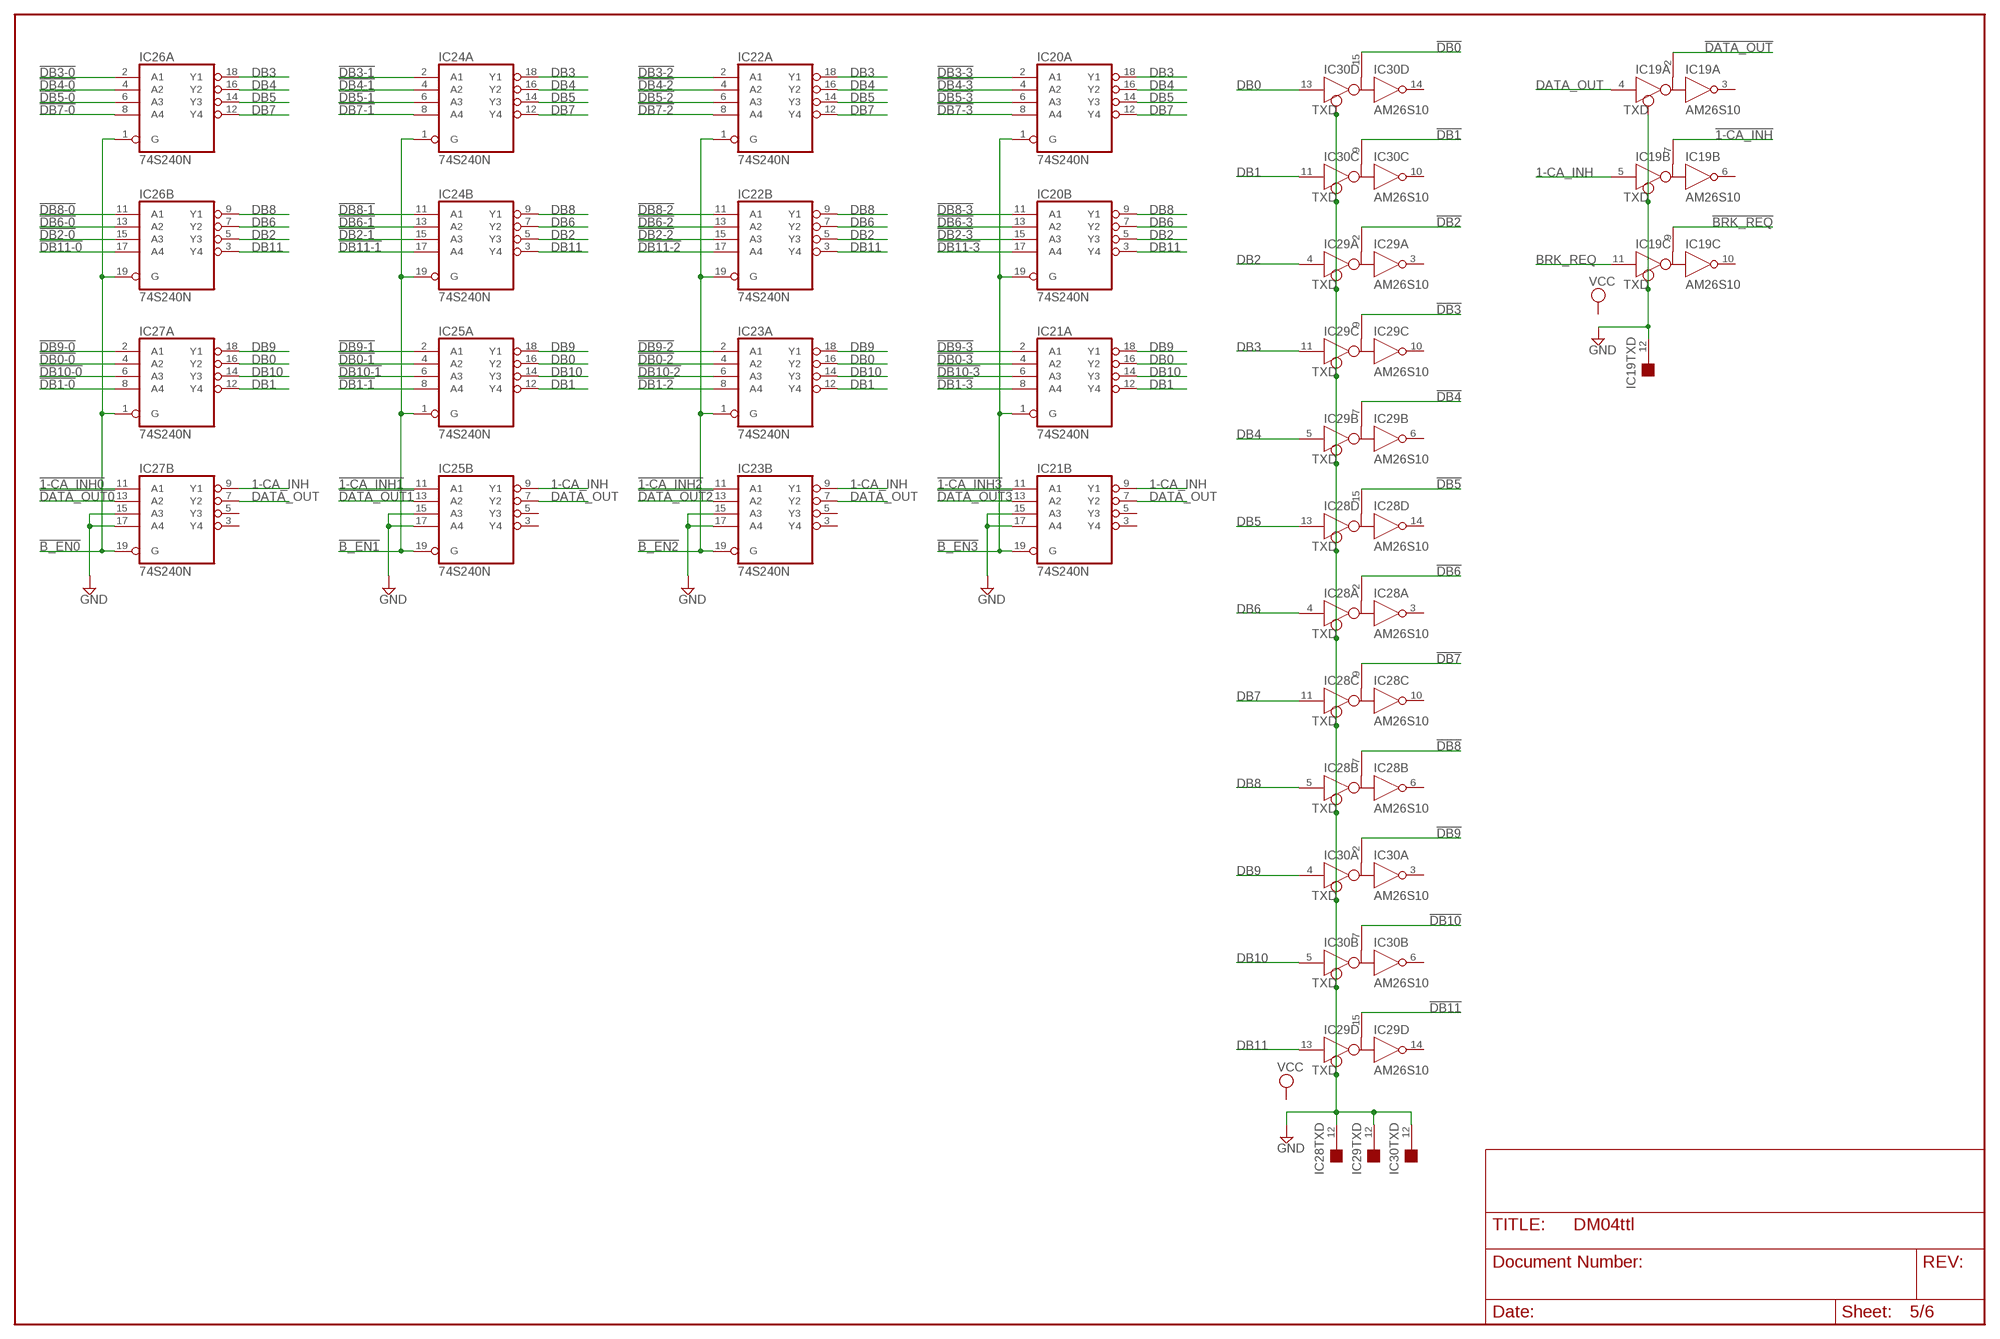
[diagram p4: schematic, sheet 5]

### Parts
IC19  AM26S10  [DIL16]
IC20  74S240N  [DIL20]
IC21  74S240N  [DIL20]
IC22  74S240N  [DIL20]
IC23  74S240N  [DIL20]
IC24  74S240N  [DIL20]
IC25  74S240N  [DIL20]
IC26  74S240N  [DIL20]
IC27  74S240N  [DIL20]
IC28  AM26S10  [DIL16]
IC29  AM26S10  [DIL16]
IC30  AM26S10  [DIL16]

### Nets
1-CA_INH: IC19.5(B:D) IC21.9(B:Y1) IC23.9(B:Y1) IC25.9(B:Y1) IC27.9(B:Y1)
!1-CA_INH: IC19.7(B:B) ; also sheet 3
!1-CA_INH0: IC27.11(B:A1) ; also sheet 3
!1-CA_INH1: IC25.11(B:A1) ; also sheet 3
!1-CA_INH2: IC23.11(B:A1) ; also sheet 3
!1-CA_INH3: IC21.11(B:A1) ; also sheet 3
!B_EN0: IC26.1(A:G) IC26.19(B:G) IC27.1(A:G) IC27.19(B:G) ; also sheet 1,6
!B_EN1: IC24.1(A:G) IC24.19(B:G) IC25.1(A:G) IC25.19(B:G) ; also sheet 1,6
!B_EN2: IC22.1(A:G) IC22.19(B:G) IC23.1(A:G) IC23.19(B:G) ; also sheet 1,6
!B_EN3: IC20.1(A:G) IC20.19(B:G) IC21.1(A:G) IC21.19(B:G) ; also sheet 1,6
!BRK_REQ: IC19.9(C:B) ; also sheet 3
!DATA_OUT: IC19.2(A:B) ; also sheet 3
!DATA_OUT0: IC27.13(B:A2) ; also sheet 3
!DATA_OUT1: IC25.13(B:A2) ; also sheet 3
!DATA_OUT2: IC23.13(B:A2) ; also sheet 3
!DATA_OUT3: IC21.13(B:A2) ; also sheet 3
!DB0: IC30.15(D:B) ; also sheet 3
!DB0-0: IC27.4(A:A2) ; also sheet 3
!DB0-1: IC25.4(A:A2) ; also sheet 3
!DB0-2: IC23.4(A:A2) ; also sheet 3
!DB0-3: IC21.4(A:A2) ; also sheet 3
!DB1: IC30.9(C:B) ; also sheet 3
!DB1-0: IC27.8(A:A4) ; also sheet 3
!DB1-1: IC25.8(A:A4) ; also sheet 3
!DB1-2: IC23.8(A:A4) ; also sheet 3
!DB1-3: IC21.8(A:A4) ; also sheet 3
!DB2: IC29.2(A:B) ; also sheet 3
!DB2-0: IC26.15(B:A3) ; also sheet 3
!DB2-1: IC24.15(B:A3) ; also sheet 3
!DB2-2: IC22.15(B:A3) ; also sheet 3
!DB2-3: IC20.15(B:A3) ; also sheet 3
!DB3: IC29.9(C:B) ; also sheet 3
!DB3-0: IC26.2(A:A1) ; also sheet 3
!DB3-1: IC24.2(A:A1) ; also sheet 3
!DB3-2: IC22.2(A:A1) ; also sheet 3
!DB3-3: IC20.2(A:A1) ; also sheet 3
!DB4: IC29.7(B:B) ; also sheet 3
!DB4-0: IC26.4(A:A2) ; also sheet 3
!DB4-1: IC24.4(A:A2) ; also sheet 3
!DB4-2: IC22.4(A:A2) ; also sheet 3
!DB4-3: IC20.4(A:A2) ; also sheet 3
!DB5: IC28.15(D:B) ; also sheet 3
!DB5-0: IC26.6(A:A3) ; also sheet 3
!DB5-1: IC24.6(A:A3) ; also sheet 3
!DB5-2: IC22.6(A:A3) ; also sheet 3
!DB5-3: IC20.6(A:A3) ; also sheet 3
!DB6: IC28.2(A:B) ; also sheet 3
!DB6-0: IC26.13(B:A2) ; also sheet 3
!DB6-1: IC24.13(B:A2) ; also sheet 3
!DB6-2: IC22.13(B:A2) ; also sheet 3
!DB6-3: IC20.13(B:A2) ; also sheet 3
!DB7: IC28.9(C:B) ; also sheet 3
!DB7-0: IC26.8(A:A4) ; also sheet 3
!DB7-1: IC24.8(A:A4) ; also sheet 3
!DB7-2: IC22.8(A:A4) ; also sheet 3
!DB7-3: IC20.8(A:A4) ; also sheet 3
!DB8: IC28.7(B:B) ; also sheet 3
!DB8-0: IC26.11(B:A1) ; also sheet 3
!DB8-1: IC24.11(B:A1) ; also sheet 3
!DB8-2: IC22.11(B:A1) ; also sheet 3
!DB8-3: IC20.11(B:A1) ; also sheet 3
!DB9: IC30.2(A:B) ; also sheet 3
!DB9-0: IC27.2(A:A1) ; also sheet 3
!DB9-1: IC25.2(A:A1) ; also sheet 3
!DB9-2: IC23.2(A:A1) ; also sheet 3
!DB9-3: IC21.2(A:A1) ; also sheet 3
!DB10: IC30.7(B:B) ; also sheet 3
!DB10-0: IC27.6(A:A3) ; also sheet 3
!DB10-1: IC25.6(A:A3) ; also sheet 3
!DB10-2: IC23.6(A:A3) ; also sheet 3
!DB10-3: IC21.6(A:A3) ; also sheet 3
!DB11: IC29.15(D:B) ; also sheet 3
!DB11-0: IC26.17(B:A4) ; also sheet 3
!DB11-1: IC24.17(B:A4) ; also sheet 3
!DB11-2: IC22.17(B:A4) ; also sheet 3
!DB11-3: IC20.17(B:A4) ; also sheet 3
BRK_REQ: IC19.11(C:D) ; also sheet 1
DATA_OUT: IC19.4(A:D) IC21.7(B:Y2) IC23.7(B:Y2) IC25.7(B:Y2) IC27.7(B:Y2)
DB0: IC21.16(A:Y2) IC23.16(A:Y2) IC25.16(A:Y2) IC27.16(A:Y2) IC30.13(D:D)
DB1: IC21.12(A:Y4) IC23.12(A:Y4) IC25.12(A:Y4) IC27.12(A:Y4) IC30.11(C:D)
DB2: IC20.5(B:Y3) IC22.5(B:Y3) IC24.5(B:Y3) IC26.5(B:Y3) IC29.4(A:D)
DB3: IC20.18(A:Y1) IC22.18(A:Y1) IC24.18(A:Y1) IC26.18(A:Y1) IC29.11(C:D)
DB4: IC20.16(A:Y2) IC22.16(A:Y2) IC24.16(A:Y2) IC26.16(A:Y2) IC29.5(B:D)
DB5: IC20.14(A:Y3) IC22.14(A:Y3) IC24.14(A:Y3) IC26.14(A:Y3) IC28.13(D:D)
DB6: IC20.7(B:Y2) IC22.7(B:Y2) IC24.7(B:Y2) IC26.7(B:Y2) IC28.4(A:D)
DB7: IC20.12(A:Y4) IC22.12(A:Y4) IC24.12(A:Y4) IC26.12(A:Y4) IC28.11(C:D)
DB8: IC20.9(B:Y1) IC22.9(B:Y1) IC24.9(B:Y1) IC26.9(B:Y1) IC28.5(B:D)
DB9: IC21.18(A:Y1) IC23.18(A:Y1) IC25.18(A:Y1) IC27.18(A:Y1) IC30.4(A:D)
DB10: IC21.14(A:Y3) IC23.14(A:Y3) IC25.14(A:Y3) IC27.14(A:Y3) IC30.5(B:D)
DB11: IC20.3(B:Y4) IC22.3(B:Y4) IC24.3(B:Y4) IC26.3(B:Y4) IC29.13(D:D)
GND [Supply]: IC19.12(TXD:TXD) IC21.15(B:A3) IC21.17(B:A4) IC23.15(B:A3) IC23.17(B:A4) IC25.15(B:A3) IC25.17(B:A4) IC27.15(B:A3) IC27.17(B:A4) IC28.12(TXD:TXD) IC29.12(TXD:TXD) IC30.12(TXD:TXD) ; also sheet 1,2,3,4,6
Unconnected: IC19.3(A:R) IC19.6(B:R) IC19.10(C:R) IC19.13(D:D) IC19.14(D:R) IC19.15(D:B) IC21.3(B:Y4) IC21.5(B:Y3) IC23.3(B:Y4) IC23.5(B:Y3) IC25.3(B:Y4) IC25.5(B:Y3) IC27.3(B:Y4) IC27.5(B:Y3) IC28.3(A:R) IC28.6(B:R) IC28.10(C:R) IC28.14(D:R) IC29.3(A:R) IC29.6(B:R) IC29.10(C:R) IC29.14(D:R) IC30.3(A:R) IC30.6(B:R) IC30.10(C:R) IC30.14(D:R)

## Sheet 6 of 6
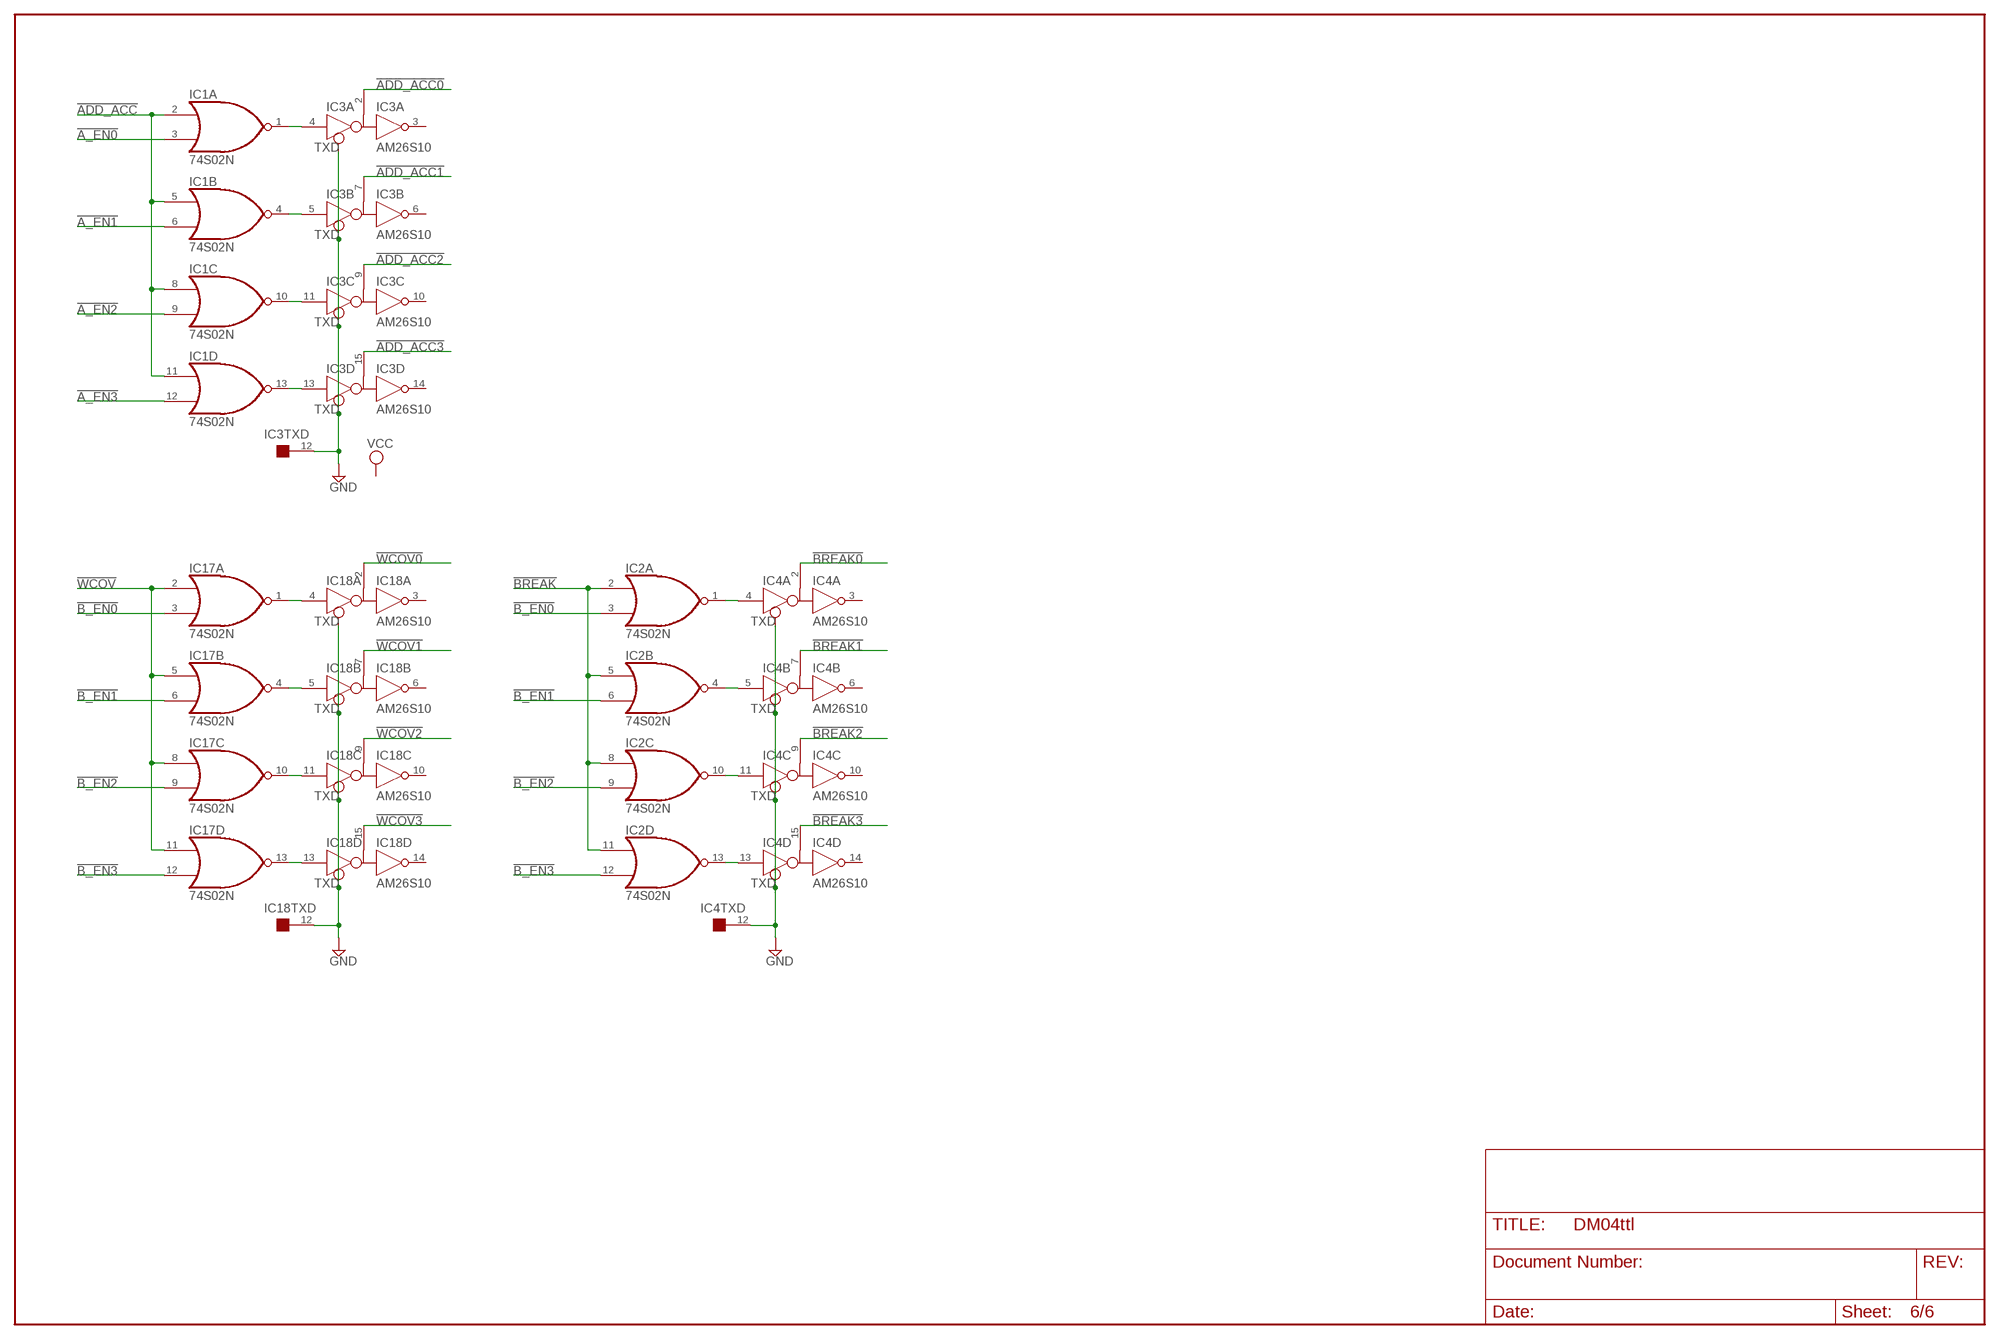
[diagram p5: schematic, sheet 6]

### Parts
IC1  74S02N  [DIL14]
IC2  74S02N  [DIL14]
IC3  AM26S10  [DIL16]
IC4  AM26S10  [DIL16]
IC17  74S02N  [DIL14]
IC18  AM26S10  [DIL16]

### Nets
!A_EN0: IC1.3(A:I1) ; also sheet 1,4
!A_EN1: IC1.6(B:I1) ; also sheet 1,4
!A_EN2: IC1.9(C:I1) ; also sheet 1,4
!A_EN3: IC1.12(D:I1) ; also sheet 1,4
!ADD_ACC: IC1.2(A:I0) IC1.5(B:I0) IC1.8(C:I0) IC1.11(D:I0) ; also sheet 1,3
!ADD_ACC0: IC3.2(A:B) ; also sheet 3
!ADD_ACC1: IC3.7(B:B) ; also sheet 3
!ADD_ACC2: IC3.9(C:B) ; also sheet 3
!ADD_ACC3: IC3.15(D:B) ; also sheet 3
!B_EN0: IC2.3(A:I1) IC17.3(A:I1) ; also sheet 1,5
!B_EN1: IC2.6(B:I1) IC17.6(B:I1) ; also sheet 1,5
!B_EN2: IC2.9(C:I1) IC17.9(C:I1) ; also sheet 1,5
!B_EN3: IC2.12(D:I1) IC17.12(D:I1) ; also sheet 1,5
!BREAK: IC2.2(A:I0) IC2.5(B:I0) IC2.8(C:I0) IC2.11(D:I0) ; also sheet 3
!BREAK0: IC4.2(A:B) ; also sheet 3
!BREAK1: IC4.7(B:B) ; also sheet 3
!BREAK2: IC4.9(C:B) ; also sheet 3
!BREAK3: IC4.15(D:B) ; also sheet 3
!WCOV: IC17.2(A:I0) IC17.5(B:I0) IC17.8(C:I0) IC17.11(D:I0) ; also sheet 3
!WCOV0: IC18.2(A:B) ; also sheet 3
!WCOV1: IC18.7(B:B) ; also sheet 3
!WCOV2: IC18.9(C:B) ; also sheet 3
!WCOV3: IC18.15(D:B) ; also sheet 3
GND [Supply]: IC3.12(TXD:TXD) IC4.12(TXD:TXD) IC18.12(TXD:TXD) ; also sheet 1,2,3,4,5
N$4: IC17.1(A:O) IC18.4(A:D)
N$10: IC17.10(C:O) IC18.11(C:D)
N$19: IC17.4(B:O) IC18.5(B:D)
N$21: IC17.13(D:O) IC18.13(D:D)
N$31: IC2.1(A:O) IC4.4(A:D)
N$33: IC2.10(C:O) IC4.11(C:D)
N$34: IC2.4(B:O) IC4.5(B:D)
N$36: IC2.13(D:O) IC4.13(D:D)
N$37: IC1.1(A:O) IC3.4(A:D)
N$38: IC1.10(C:O) IC3.11(C:D)
N$39: IC1.4(B:O) IC3.5(B:D)
N$41: IC1.13(D:O) IC3.13(D:D)
Unconnected: IC3.3(A:R) IC3.6(B:R) IC3.10(C:R) IC3.14(D:R) IC4.3(A:R) IC4.6(B:R) IC4.10(C:R) IC4.14(D:R) IC18.3(A:R) IC18.6(B:R) IC18.10(C:R) IC18.14(D:R)

## Power pins joined to a net without a drawn wire
GND: AC0.A AC0.AA AC0.B AC0.C AC0.CC AC0.E AC0.EE AC0.H AC0.HH AC0.K AC0.KK AC0.M AC0.MM AC0.P AC0.PP AC0.S AC0.SS AC0.U AC0.UU AC0.VV AC0.W AC0.Y AC1.A AC1.AA AC1.B AC1.C AC1.CC AC1.E AC1.EE AC1.H AC1.HH AC1.K AC1.KK AC1.M AC1.MM AC1.P AC1.PP AC1.S AC1.SS AC1.U AC1.UU AC1.VV AC1.W AC1.Y ADDRESS0.A ADDRESS0.AA ADDRESS0.B ADDRESS0.C ADDRESS0.CC ADDRESS0.E ADDRESS0.EE ADDRESS0.H ADDRESS0.HH ADDRESS0.K ADDRESS0.KK ADDRESS0.M ADDRESS0.MM ADDRESS0.P ADDRESS0.PP ADDRESS0.S ADDRESS0.SS ADDRESS0.U ADDRESS0.UU ADDRESS0.VV ADDRESS0.W ADDRESS0.Y ADDRESS1.A ADDRESS1.AA ADDRESS1.B ADDRESS1.C ADDRESS1.CC ADDRESS1.E ADDRESS1.EE ADDRESS1.H ADDRESS1.HH ADDRESS1.K ADDRESS1.KK ADDRESS1.M ADDRESS1.MM ADDRESS1.P ADDRESS1.PP ADDRESS1.S ADDRESS1.SS ADDRESS1.U ADDRESS1.UU ADDRESS1.VV ADDRESS1.W ADDRESS1.Y ADDRESS2.A ADDRESS2.AA ADDRESS2.B ADDRESS2.C ADDRESS2.CC ADDRESS2.E ADDRESS2.EE ADDRESS2.H ADDRESS2.HH ADDRESS2.K ADDRESS2.KK ADDRESS2.M ADDRESS2.MM ADDRESS2.P ADDRESS2.PP ADDRESS2.S ADDRESS2.SS ADDRESS2.U ADDRESS2.UU ADDRESS2.VV ADDRESS2.W ADDRESS2.Y ADDRESS3.A ADDRESS3.AA ADDRESS3.B ADDRESS3.C ADDRESS3.CC ADDRESS3.E ADDRESS3.EE ADDRESS3.H ADDRESS3.HH ADDRESS3.K ADDRESS3.KK ADDRESS3.M ADDRESS3.MM ADDRESS3.P ADDRESS3.PP ADDRESS3.S ADDRESS3.SS ADDRESS3.U ADDRESS3.UU ADDRESS3.VV ADDRESS3.W ADDRESS3.Y ADDRESS.A ADDRESS.AA ADDRESS.B ADDRESS.C ADDRESS.CC ADDRESS.E ADDRESS.EE ADDRESS.H ADDRESS.HH ADDRESS.K ADDRESS.KK ADDRESS.M ADDRESS.MM ADDRESS.P ADDRESS.PP ADDRESS.S ADDRESS.SS ADDRESS.U ADDRESS.UU ADDRESS.VV ADDRESS.W ADDRESS.Y BAC0.A BAC0.AA BAC0.B BAC0.C BAC0.CC BAC0.E BAC0.EE BAC0.H BAC0.HH BAC0.K BAC0.KK BAC0.M BAC0.MM BAC0.P BAC0.PP BAC0.S BAC0.SS BAC0.U BAC0.UU BAC0.VV BAC0.W BAC0.Y BAC1.A BAC1.AA BAC1.B BAC1.C BAC1.CC BAC1.E BAC1.EE BAC1.H BAC1.HH BAC1.K BAC1.KK BAC1.M BAC1.MM BAC1.P BAC1.PP BAC1.S BAC1.SS BAC1.U BAC1.UU BAC1.VV BAC1.W BAC1.Y BMB0.A BMB0.AA BMB0.B BMB0.C BMB0.CC BMB0.E BMB0.EE BMB0.H BMB0.HH BMB0.K BMB0.KK BMB0.M BMB0.MM BMB0.P BMB0.PP BMB0.S BMB0.SS BMB0.U BMB0.UU BMB0.VV BMB0.W BMB0.Y BMB1.A BMB1.AA BMB1.B BMB1.C BMB1.CC BMB1.E BMB1.EE BMB1.H BMB1.HH BMB1.K BMB1.KK BMB1.M BMB1.MM BMB1.P BMB1.PP BMB1.S BMB1.SS BMB1.U BMB1.UU BMB1.VV BMB1.W BMB1.Y DATA0.A DATA0.AA DATA0.B DATA0.C DATA0.CC DATA0.E DATA0.EE DATA0.H DATA0.HH DATA0.K DATA0.KK DATA0.M DATA0.MM DATA0.P DATA0.PP DATA0.S DATA0.SS DATA0.U DATA0.UU DATA0.VV DATA0.W DATA0.Y DATA1.A DATA1.AA DATA1.B DATA1.C DATA1.CC DATA1.E DATA1.EE DATA1.H DATA1.HH DATA1.K DATA1.KK DATA1.M DATA1.MM DATA1.P DATA1.PP DATA1.S DATA1.SS DATA1.U DATA1.UU DATA1.VV DATA1.W DATA1.Y DATA2.A DATA2.AA DATA2.B DATA2.C DATA2.CC DATA2.E DATA2.EE DATA2.H DATA2.HH DATA2.K DATA2.KK DATA2.M DATA2.MM DATA2.P DATA2.PP DATA2.S DATA2.SS DATA2.U DATA2.UU DATA2.VV DATA2.W DATA2.Y DATA3.A DATA3.AA DATA3.B DATA3.C DATA3.CC DATA3.E DATA3.EE DATA3.H DATA3.HH DATA3.K DATA3.KK DATA3.M DATA3.MM DATA3.P DATA3.PP DATA3.S DATA3.SS DATA3.U DATA3.UU DATA3.VV DATA3.W DATA3.Y DATA.A DATA.AA DATA.B DATA.C DATA.CC DATA.E DATA.EE DATA.H DATA.HH DATA.K DATA.KK DATA.M DATA.MM DATA.P DATA.PP DATA.S DATA.SS DATA.U DATA.UU DATA.VV DATA.W DATA.Y IC1.7(P:GND) IC2.7(P:GND) IC3.1(GND:GND) IC3.8(PWR:GND) IC4.1(GND:GND) IC4.8(PWR:GND) IC5.1(GND:GND) IC5.8(PWR:GND) IC6.10(P:GND) IC7.10(P:GND) IC8.10(P:GND) IC9.10(P:GND) IC10.10(P:GND) IC11.10(P:GND) IC12.10(P:GND) IC13.10(P:GND) IC14.1(GND:GND) IC14.8(PWR:GND) IC15.1(GND:GND) IC15.8(PWR:GND) IC16.1(GND:GND) IC16.8(PWR:GND) IC17.7(P:GND) IC18.1(GND:GND) IC18.8(PWR:GND) IC19.1(GND:GND) IC19.8(PWR:GND) IC20.10(P:GND) IC21.10(P:GND) IC22.10(P:GND) IC23.10(P:GND) IC24.10(P:GND) IC25.10(P:GND) IC26.10(P:GND) IC27.10(P:GND) IC28.1(GND:GND) IC28.8(PWR:GND) IC29.1(GND:GND) IC29.8(PWR:GND) IC30.1(GND:GND) IC30.8(PWR:GND) IC31.8(GND) IC32.8(GND) IC33.10(GND) IC34.7(P:GND) IC35.10(GND)
VCC: IC1.14(P:VCC) IC2.14(P:VCC) IC3.16(PWR:VCC) IC4.16(PWR:VCC) IC5.16(PWR:VCC) IC6.20(P:VCC) IC7.20(P:VCC) IC8.20(P:VCC) IC9.20(P:VCC) IC10.20(P:VCC) IC11.20(P:VCC) IC12.20(P:VCC) IC13.20(P:VCC) IC14.16(PWR:VCC) IC15.16(PWR:VCC) IC16.16(PWR:VCC) IC17.14(P:VCC) IC18.16(PWR:VCC) IC19.16(PWR:VCC) IC20.20(P:VCC) IC21.20(P:VCC) IC22.20(P:VCC) IC23.20(P:VCC) IC24.20(P:VCC) IC25.20(P:VCC) IC26.20(P:VCC) IC27.20(P:VCC) IC28.16(PWR:VCC) IC29.16(PWR:VCC) IC30.16(PWR:VCC) IC31.16(VCC) IC32.16(VCC) IC33.20(VCC) IC34.14(P:VCC) IC35.20(VCC)

## Library data of the parts
AC0 AC1 ADDRESS ADDRESS0 ADDRESS1-ADDRESS3 BAC0 BAC1 BMB0 BMB1 DATA DATA0 DATA1-DATA3 = dec-con:BC08J: BC08J compatible bus connector
C1-C38 = rcl:C-US: CAPACITOR, American symbol
C96-C99 = rcl:CPOL-US: POLARIZED CAPACITOR, American symbol
E1-E3 = ic-package:DIL20: Dual In Line / Socket
IC1 IC2 IC17 = 74xx-us:74*02: Quad 2-input NOR gate
IC3-IC5 IC14-IC16 IC18 IC19 IC28-IC30 = dec-con:AM26S10: Bus Transceiver
IC6-IC13 IC20-IC27 = 74xx-us:74*240: Octal BUFFER and LINE DRIVER, 3-state
IC31 = 74xx-us:74*148: 10-line to 4-line and 8-line to 3-line PRIORITY ENCODER
IC32 = 74xx-us:74*138: 3-line to 8-line DECODER/DEMULTIPLEXER
IC33 IC35 = 74xx-us:74*273: Octal D type FLIP FLOP, clear
IC34 = 74xx-us:74*86: Quad 2-input EXCLUSIV-OR (XOR) gate
RN1 RN2 RN5-RN10 RN13-RN20 = resistor-sil:GE09R: SIL RESISTOR; OC_FARNELL: unknown; OC_NEWARK: unknown
SV1 = con-lstb:MA10-2: PIN HEADER; OC_FARNELL: unknown; OC_NEWARK: unknown

## Net classes
1 Supply: width 0.635 mm, clearance 0.381 mm